# EAGLE schematic Blueberry Pi (EAGLE 9.0.0)

## Sheet 1 of 6: IO / LRADC / RTL8237BS / Touch / SPI Flash
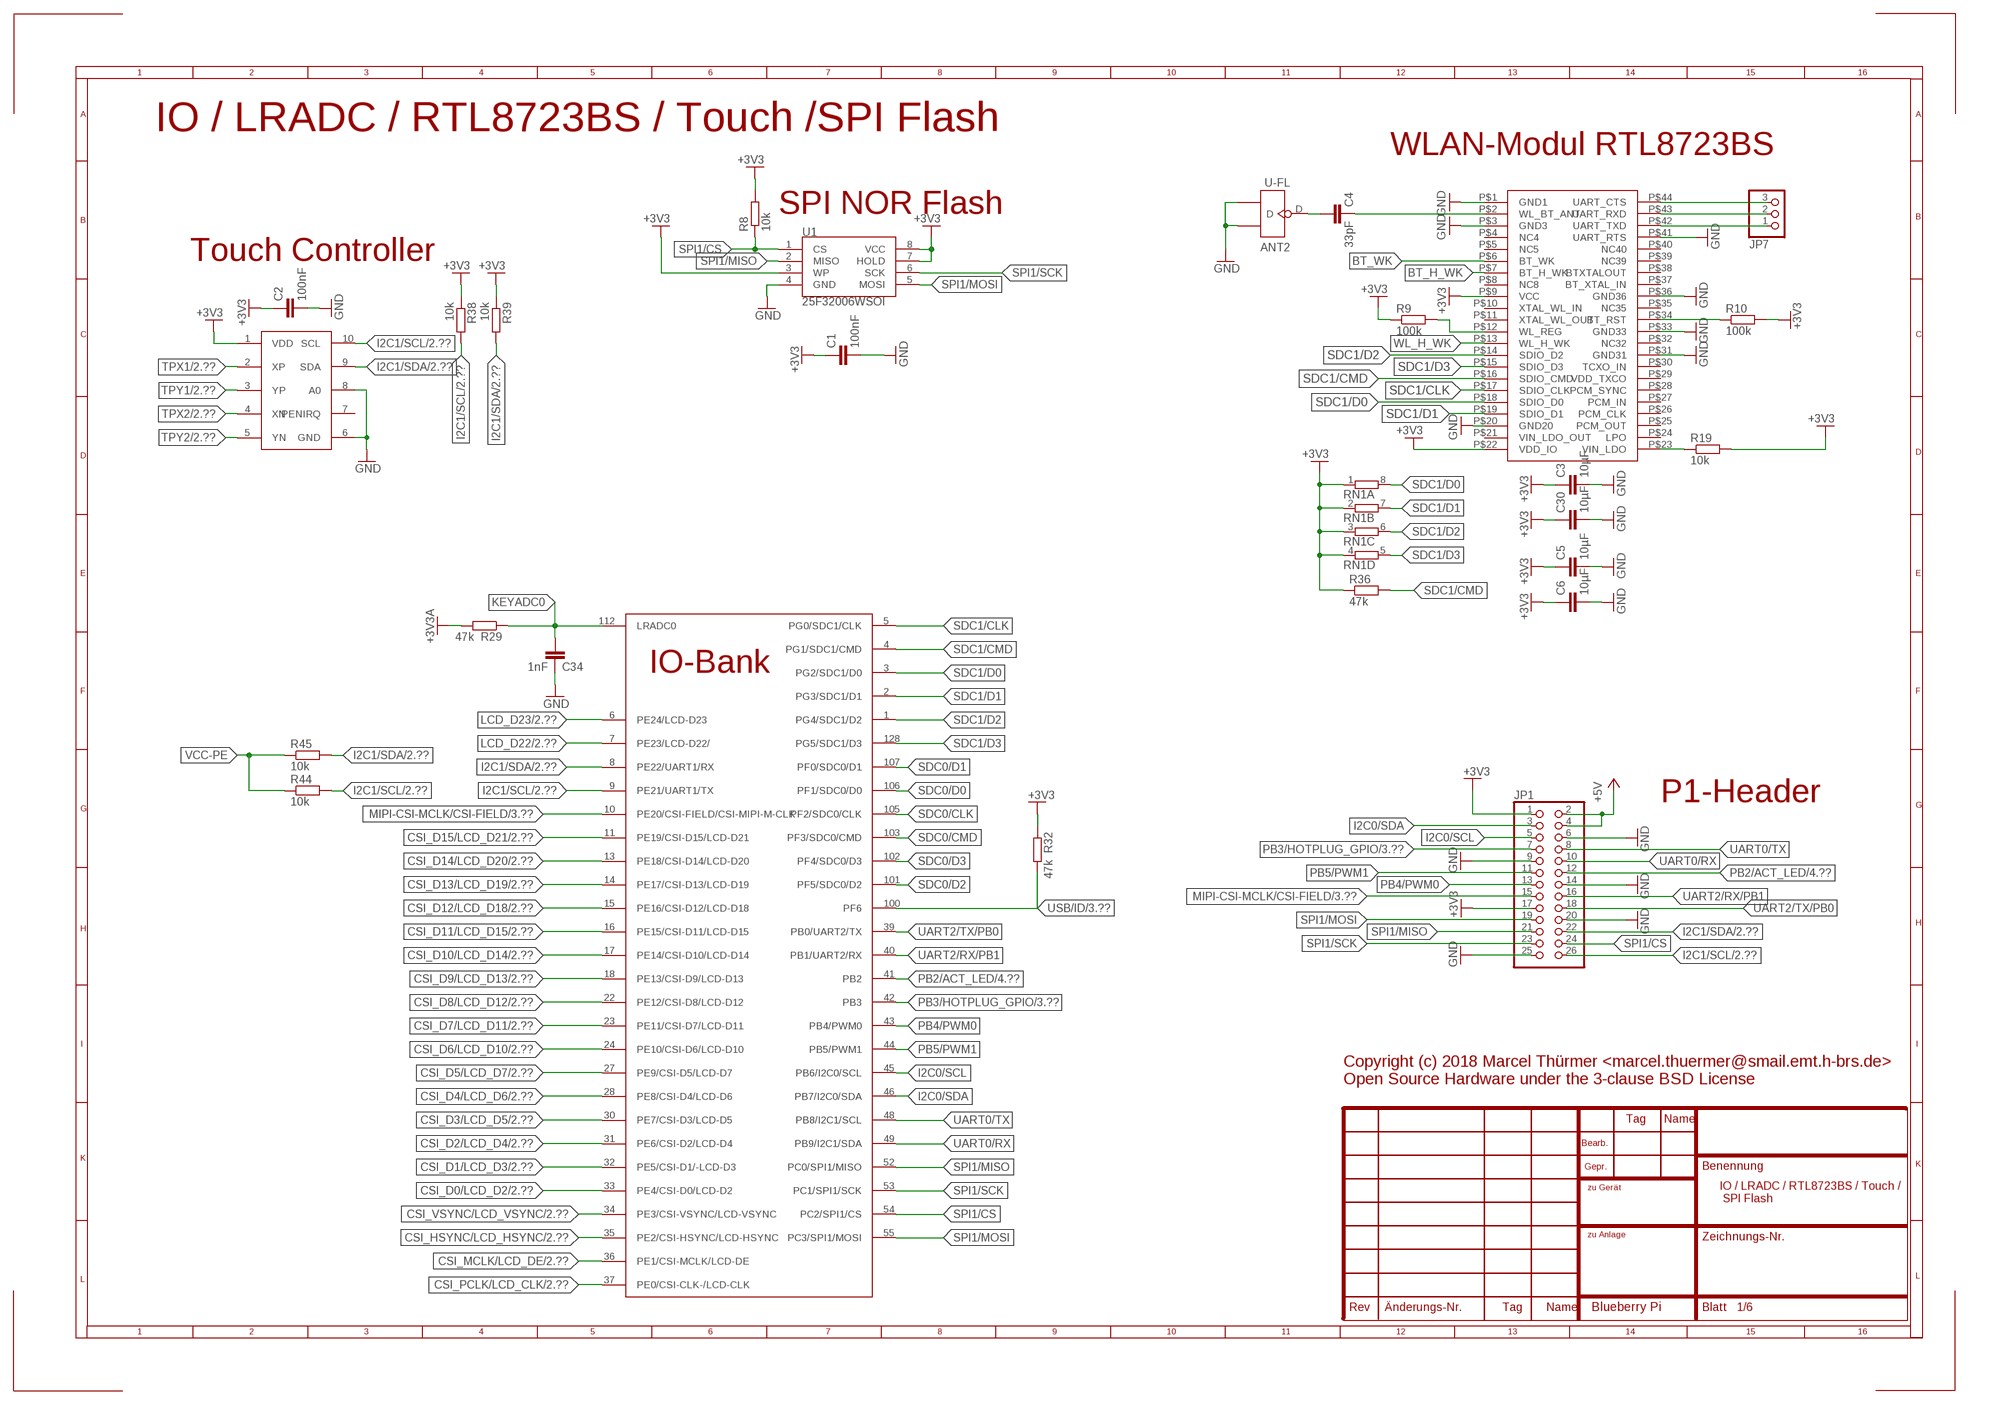
[diagram p0: schematic, sheet 1]

### Parts
ANT2  U-FL  ANTENNA-CONN-U-FL(3P)  [U-FL3P-SMD-2.6X2.6X1.0MM]
C1  100nF  C-EUC0603  [C0603]
C2  100nF  C-EUC0603  [C0603]
C3  10µF  C-EUC0805  [C0805]
C4  33pF  C-EUC0603  [C0603]
C5  10µF  C-EUC0805  [C0805]
C6  10µF  C-EUC0805  [C0805]
C30  10µF  C-EUC0805  [C0805]
C34  1nF  C-EUC0603  [C0603]
JP1  PINHD-2X13  [2X13]
JP7  PINHD-1X3M  [1X03M]
R8  10k  R-EU_R0603  [R0603]
R9  100k  R-EU_R0603  [R0603]
R10  100k  R-EU_R0603  [R0603]
R19  10k  R-EU_R0603  [R0603]
R29  47k  R-EU_R0603  [R0603]
R32  47k  R-EU_R0603  [R0603]
R36  47k  R-EU_R0603  [R0603]
R38  10k  R-EU_R0603  [R0603]
R39  10k  R-EU_R0603  [R0603]
R44  10k  R-EU_R0603  [R0603]
R45  10k  R-EU_R0603  [R0603]
RN1  4R-NEXB38V  [EXB38V]
U1  25F32006WSOI  SPI_FLASH-X25XXSMD1  [SO08-EIAJ]
U$1  V3S  [QFP-128]
U$2  RTL8723BS  [LGA]
U$8  NS2009  [MSOP10]

### Nets
+3V3: C1.1 C2.1 C3.1 C5.1 C6.1 C30.1 JP1.1 JP1.17 R8.2 R9.1 R10.2 R19.2 R32.1 R36.1 R38.1 R39.1 RN1.1 RN1.2 RN1.3 RN1.4 U1.3(WP) U1.7(HOLD) U1.8(VCC) U$2.P$9(VCC) U$2.P$22(VDD_IO) U$8.1(VDD) ; also sheet 2,3,4,6
+3V3A: R29.2 ; also sheet 3,4
+5V: JP1.2 JP1.4 ; also sheet 3,4,5,6
BT_H_WK: U$2.P$7(BT_H_WK)
BT_WK: U$2.P$6(BT_WK)
CSI_D0/LCD_D2: U$1.33(PE4/CSI-D0/LCD-D2) ; also sheet 2,5,6
CSI_D1/LCD_D3: U$1.32(PE5/CSI-D1/-LCD-D3) ; also sheet 2,5,6
CSI_D2/LCD_D4: U$1.31(PE6/CSI-D2/LCD-D4) ; also sheet 2,5,6
CSI_D3/LCD_D5: U$1.30(PE7/CSI-D3/LCD-D5) ; also sheet 2,5,6
CSI_D4/LCD_D6: U$1.28(PE8/CSI-D4/LCD-D6) ; also sheet 2,5,6
CSI_D5/LCD_D7: U$1.27(PE9/CSI-D5/LCD-D7) ; also sheet 2,5,6
CSI_D6/LCD_D10: U$1.24(PE10/CSI-D6/LCD-D10) ; also sheet 2,5,6
CSI_D7/LCD_D11: U$1.23(PE11/CSI-D7/LCD-D11) ; also sheet 2,5,6
CSI_D8/LCD_D12: U$1.22(PE12/CSI-D8/LCD-D12) ; also sheet 2,5,6
CSI_D9/LCD_D13: U$1.18(PE13/CSI-D9/LCD-D13) ; also sheet 2,5,6
CSI_D10/LCD_D14: U$1.17(PE14/CSI-D10/LCD-D14) ; also sheet 2,5,6
CSI_D11/LCD_D15: U$1.16(PE15/CSI-D11/LCD-D15) ; also sheet 2,5,6
CSI_D12/LCD_D18: U$1.15(PE16/CSI-D12/LCD-D18) ; also sheet 2,5,6
CSI_D13/LCD_D19: U$1.14(PE17/CSI-D13/LCD-D19) ; also sheet 2,5,6
CSI_D14/LCD_D20: U$1.13(PE18/CSI-D14/LCD-D20) ; also sheet 2,5,6
CSI_D15/LCD_D21: U$1.11(PE19/CSI-D15/LCD-D21) ; also sheet 2,5,6
CSI_HSYNC/LCD_HSYNC: U$1.35(PE2/CSI-HSYNC/LCD-HSYNC) ; also sheet 2,5,6
CSI_MCLK/LCD_DE: U$1.36(PE1/CSI-MCLK/LCD-DE) ; also sheet 2,5
CSI_PCLK/LCD_CLK: U$1.37(PE0/CSI-CLK-/LCD-CLK) ; also sheet 2,5
CSI_VSYNC/LCD_VSYNC: U$1.34(PE3/CSI-VSYNC/LCD-VSYNC) ; also sheet 2,5,6
GND: ANT2.GND1 ANT2.GND2 C1.2 C2.2 C3.2 C5.2 C6.2 C30.2 C34.1 JP1.6 JP1.9 JP1.14 JP1.20 JP1.25 U1.4(GND) U$2.P$1(GND1) U$2.P$3(GND3) U$2.P$20(GND20) U$2.P$31(GND31) U$2.P$33(GND33) U$2.P$36(GND36) U$2.P$41(UART_RTS) U$8.6(GND) U$8.8(A0) ; also sheet 2,3,4,5,6
I2C0/SCL: JP1.5 U$1.45(PB6/I2C0/SCL)
I2C0/SDA: JP1.3 U$1.46(PB7/I2C0/SDA)
I2C1/SCL: JP1.26 R38.2 R44.2 U$1.9(PE21/UART1/TX) U$8.10(SCL) ; also sheet 2,3,5
I2C1/SDA: JP1.22 R39.2 R45.2 U$1.8(PE22/UART1/RX) U$8.9(SDA) ; also sheet 2,3,5
KEYADC0: C34.2 R29.1 U$1.112(LRADC0)
LCD_D22: U$1.7(PE23/LCD-D22/) ; also sheet 2,6
LCD_D23: U$1.6(PE24/LCD-D23) ; also sheet 2,6
MIPI-CSI-MCLK/CSI-FIELD: JP1.15 U$1.10(PE20/CSI-FIELD/CSI-MIPI-M-CLK) ; also sheet 3
N$2: ANT2.D C4.2
N$4: R19.1 U$2.P$23(VIN_LDO)
N$5: JP7.3 U$2.P$44(UART_CTS)
N$7: R9.2 U$2.P$12(WL_REG)
N$9: JP7.2 U$2.P$43(UART_RXD)
N$11: JP7.1 U$2.P$42(UART_TXD)
N$12: R10.1 U$2.P$34(BT_RST)
N$13: C4.1 U$2.P$2(WL_BT_ANT)
PB2/ACT_LED: JP1.12 U$1.41(PB2) ; also sheet 4
PB3/HOTPLUG_GPIO: JP1.7 U$1.42(PB3) ; also sheet 3,5
PB4/PWM0: JP1.13 U$1.43(PB4/PWM0)
PB5/PWM1: JP1.11 U$1.44(PB5/PWM1)
SDC0/CLK: U$1.105(PF2/SDC0/CLK) ; also sheet 3
SDC0/CMD: U$1.103(PF3/SDC0/CMD) ; also sheet 3
SDC0/D0: U$1.106(PF1/SDC0/D0) ; also sheet 3
SDC0/D1: U$1.107(PF0/SDC0/D1) ; also sheet 3
SDC0/D2: U$1.101(PF5/SDC0/D2) ; also sheet 3
SDC0/D3: U$1.102(PF4/SDC0/D3) ; also sheet 3
SDC1/CLK: U$1.5(PG0/SDC1/CLK) U$2.P$17(SDIO_CLK)
SDC1/CMD: R36.2 U$1.4(PG1/SDC1/CMD) U$2.P$16(SDIO_CMD)
SDC1/D0: RN1.8 U$1.3(PG2/SDC1/D0) U$2.P$18(SDIO_D0)
SDC1/D1: RN1.7 U$1.2(PG3/SDC1/D1) U$2.P$19(SDIO_D1)
SDC1/D2: RN1.6 U$1.1(PG4/SDC1/D2) U$2.P$14(SDIO_D2)
SDC1/D3: RN1.5 U$1.128(PG5/SDC1/D3) U$2.P$15(SDIO_D3)
SPI1/CS: JP1.24 R8.1 U1.1(CS) U$1.54(PC2/SPI1/CS)
SPI1/MISO: JP1.21 U1.2(MISO) U$1.52(PC0/SPI1/MISO)
SPI1/MOSI: JP1.19 U1.5(MOSI) U$1.55(PC3/SPI1/MOSI)
SPI1/SCK: JP1.23 U1.6(SCK) U$1.53(PC1/SPI1/SCK)
TPX1: U$8.2(XP) ; also sheet 2
TPX2: U$8.4(XN) ; also sheet 2
TPY1: U$8.3(YP) ; also sheet 2
TPY2: U$8.5(YN) ; also sheet 2
UART0/RX: JP1.10 U$1.49(PB9/I2C1/SDA)
UART0/TX: JP1.8 U$1.48(PB8/I2C1/SCL)
UART2/RX/PB1: JP1.16 U$1.40(PB1/UART2/RX)
UART2/TX/PB0: JP1.18 U$1.39(PB0/UART2/TX)
USB/ID: R32.2 U$1.100(PF6) ; also sheet 3
VCC-PE: R44.1 R45.1 ; also sheet 4
WL_H_WK: U$2.P$13(WL_H_WK)
Unconnected: U$2.P$4(NC4) U$2.P$5(NC5) U$2.P$8(NC8) U$2.P$10(XTAL_WL_IN) U$2.P$11(XTAL_WL_OUT) U$2.P$21(VIN_LDO_OUT) U$2.P$24(LPO) U$2.P$25(PCM_OUT) U$2.P$26(PCM_CLK) U$2.P$27(PCM_IN) U$2.P$28(PCM_SYNC) U$2.P$29(VDD_TXCO) U$2.P$30(TCXO_IN) U$2.P$32(NC32) U$2.P$35(NC35) U$2.P$37(BT_XTAL_IN) U$2.P$38(BTXTALOUT) U$2.P$39(NC39) U$2.P$40(NC40) U$8.7(PENIRQ)

### Notes on the sheet
- IO / LRADC / RTL8723BS / Touch /SPI Flash
- WLAN-Modul RTL8723BS
- SPI NOR Flash
- Touch Controller
- P1-Header
- Copyright (c) 2018 Marcel Thürmer <marcel.thuermer@smail.emt.h-brs.de>
  Open Source Hardware under the 3-clause BSD License
- IO / LRADC / RTL8723BS / Touch /
   SPI Flash

## Sheet 2 of 6: LCD FFC / Camera FFC / Camera Header (OV7670, OV2640)
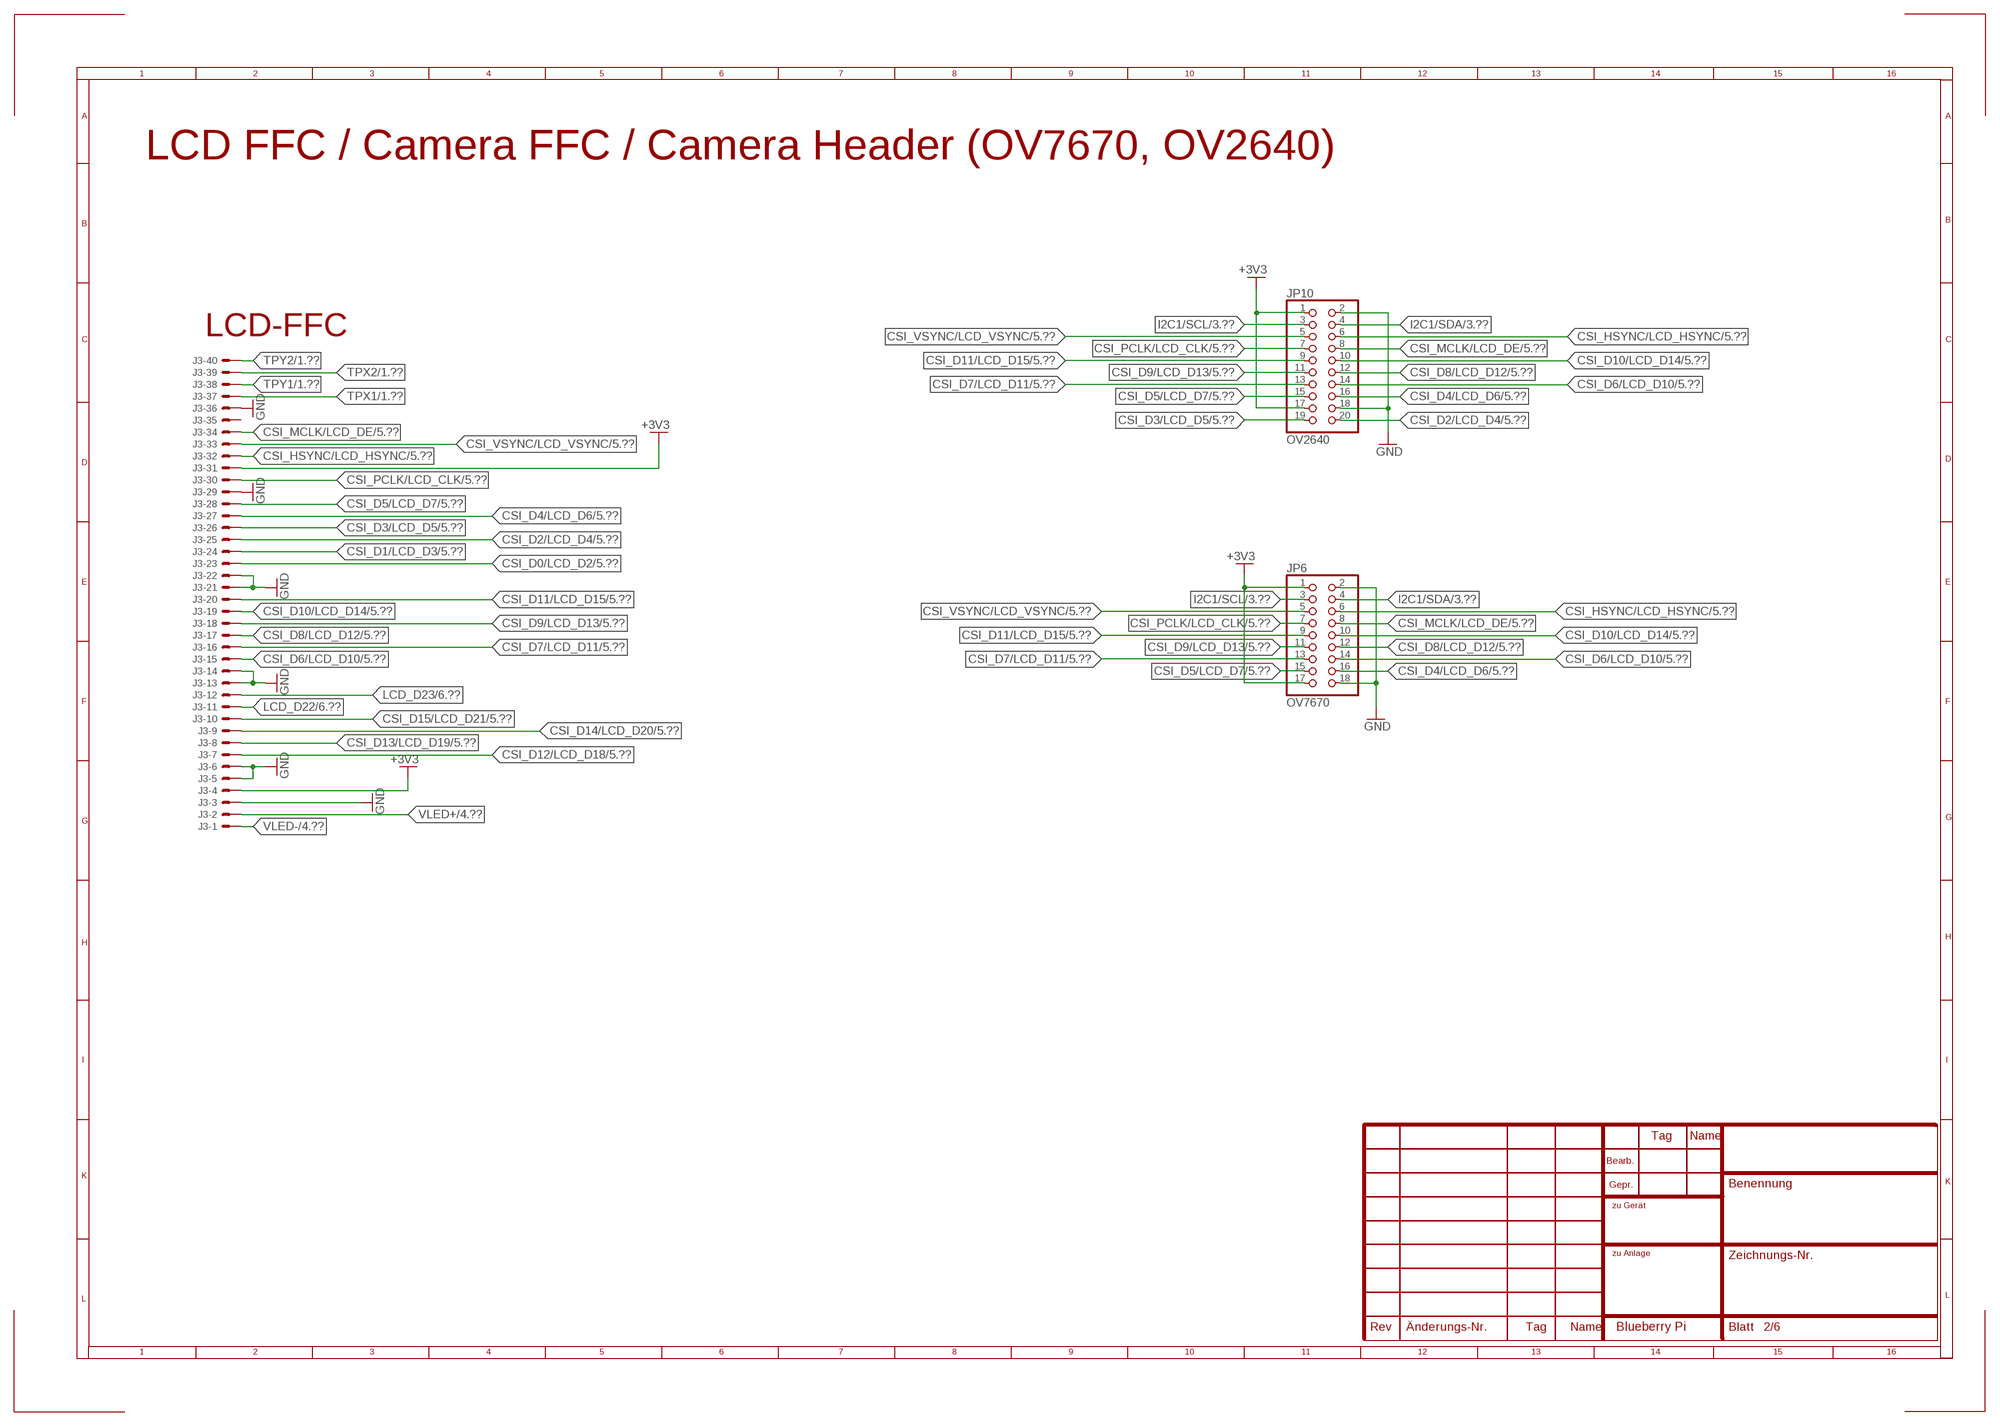
[diagram p1: schematic, sheet 2]

### Parts
J3  40PINFPCH15-1LW  [XF2H-4015-1LW]
JP6  OV7670  PINHD-2X9  [2X09]
JP10  OV2640  PINHD-2X10  [2X10]

### Nets
+3V3: J3.4 J3.31 JP6.1 JP6.17 JP10.1 JP10.17 ; also sheet 1,3,4,6
CSI_D0/LCD_D2: J3.23 ; also sheet 1,5,6
CSI_D1/LCD_D3: J3.24 ; also sheet 1,5,6
CSI_D2/LCD_D4: J3.25 JP10.20 ; also sheet 1,5,6
CSI_D3/LCD_D5: J3.26 JP10.19 ; also sheet 1,5,6
CSI_D4/LCD_D6: J3.27 JP6.16 JP10.16 ; also sheet 1,5,6
CSI_D5/LCD_D7: J3.28 JP6.15 JP10.15 ; also sheet 1,5,6
CSI_D6/LCD_D10: J3.15 JP6.14 JP10.14 ; also sheet 1,5,6
CSI_D7/LCD_D11: J3.16 JP6.13 JP10.13 ; also sheet 1,5,6
CSI_D8/LCD_D12: J3.17 JP6.12 JP10.12 ; also sheet 1,5,6
CSI_D9/LCD_D13: J3.18 JP6.11 JP10.11 ; also sheet 1,5,6
CSI_D10/LCD_D14: J3.19 JP6.10 JP10.10 ; also sheet 1,5,6
CSI_D11/LCD_D15: J3.20 JP6.9 JP10.9 ; also sheet 1,5,6
CSI_D12/LCD_D18: J3.7 ; also sheet 1,5,6
CSI_D13/LCD_D19: J3.8 ; also sheet 1,5,6
CSI_D14/LCD_D20: J3.9 ; also sheet 1,5,6
CSI_D15/LCD_D21: J3.10 ; also sheet 1,5,6
CSI_HSYNC/LCD_HSYNC: J3.32 JP6.6 JP10.6 ; also sheet 1,5,6
CSI_MCLK/LCD_DE: J3.34 JP6.8 JP10.8 ; also sheet 1,5
CSI_PCLK/LCD_CLK: J3.30 JP6.7 JP10.7 ; also sheet 1,5
CSI_VSYNC/LCD_VSYNC: J3.33 JP6.5 JP10.5 ; also sheet 1,5,6
GND: J3.3 J3.5 J3.6 J3.13 J3.14 J3.21 J3.22 J3.29 J3.36 JP6.2 JP6.18 JP10.2 JP10.18 ; also sheet 1,3,4,5,6
I2C1/SCL: JP6.3 JP10.3 ; also sheet 1,3,5
I2C1/SDA: JP6.4 JP10.4 ; also sheet 1,3,5
LCD_D22: J3.11 ; also sheet 1,6
LCD_D23: J3.12 ; also sheet 1,6
TPX1: J3.37 ; also sheet 1
TPX2: J3.39 ; also sheet 1
TPY1: J3.38 ; also sheet 1
TPY2: J3.40 ; also sheet 1
VLED+: J3.2 ; also sheet 4
VLED-: J3.1 ; also sheet 4
Unconnected: J3.35

### Notes on the sheet
- LCD FFC / Camera FFC / Camera Header (OV7670, OV2640)
- LCD-FFC

## Sheet 3 of 6: Ethernet / USB Host / SDC0 / Audio / MIPI CSI
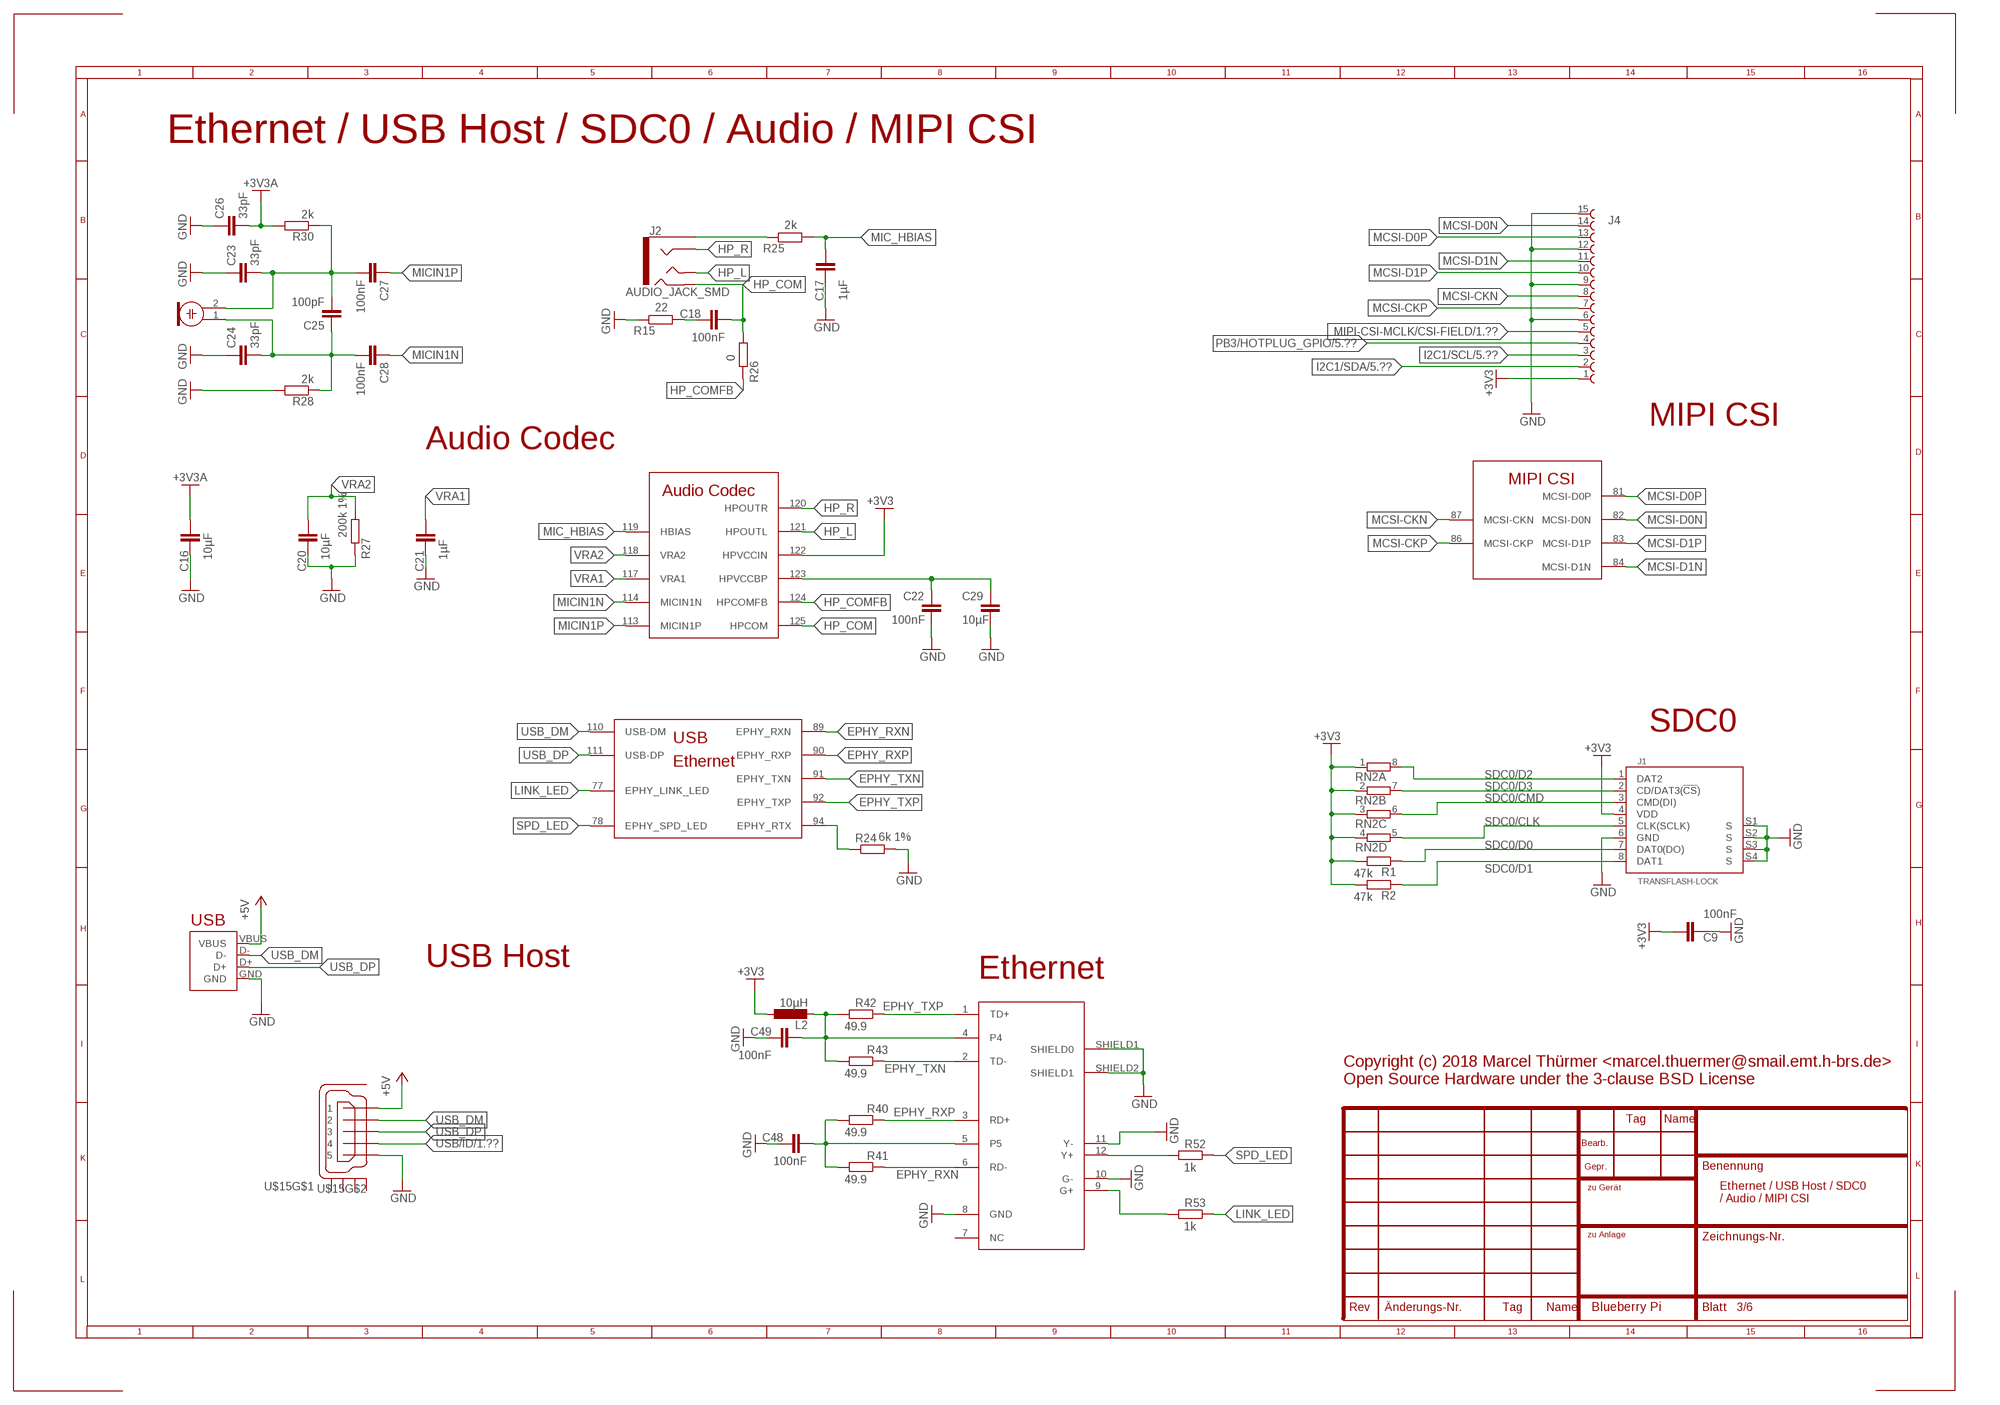
[diagram p2: schematic, sheet 3]

### Parts
C9  100nF  C-EUC0603  [C0603]
C16  10µF  C-EUC0805  [C0805]
C17  1µF  C-EUC0603  [C0603]
C18  100nF  C-EUC0603  [C0603]
C20  10µF  C-EUC0805  [C0805]
C21  1µF  C-EUC0603  [C0603]
C22  100nF  C-EUC0603  [C0603]
C23  33pF  C-EUC0603  [C0603]
C24  33pF  C-EUC0603  [C0603]
C25  100pF  C-EUC0603  [C0603]
C26  33pF  C-EUC0603  [C0603]
C27  100nF  C-EUC0603  [C0603]
C28  100nF  C-EUC0603  [C0603]
C29  10µF  C-EUC0805  [C0805]
C48  100nF  C-EUC0603  [C0603]
C49  100nF  C-EUC0603  [C0603]
J1  TRANSFLASH-LOCK  [TRANSFLASH-LOCK-SOCK]
J2  AUDIO_JACK_SMD  AUDIO_JACK_TRRSSMD_RA  [AUDIO_JACK_3.5MM_TRRS_SMD_RA]
J4  68611514122  [68611514122]
L2  10µH  L-EUL0805  [L0805]
MIC  ELECTRET_MICROPHON-F6035AP  [F6035AP]
R1  47k  R-EU_R0603  [R0603]
R2  47k  R-EU_R0603  [R0603]
R15  22  R-EU_R0603  [R0603]
R24  6k 1%  R-EU_R0603  [R0603]
R25  2k  R-EU_R0603  [R0603]
R26  0  R-EU_R0603  [R0603]
R27  200k 1%  R-EU_R0603  [R0603]
R28  2k  R-EU_R0603  [R0603]
R30  2k  R-EU_R0603  [R0603]
R40  49.9  R-EU_R0603  [R0603]
R41  49.9  R-EU_R0603  [R0603]
R42  49.9  R-EU_R0603  [R0603]
R43  49.9  R-EU_R0603  [R0603]
R52  1k  R-EU_R0603  [R0603]
R53  1k  R-EU_R0603  [R0603]
RN2  4R-NEXB38V  [EXB38V]
U$3  HR911105A  [RJ45]
U$15  CON-HIROSE_MICRO-USB-SHIELD-ZX62R-B-5P  [CON-HIROSE_ZX62R-B-5P]
X1  USB-B-S  [USB-B-SMT]

### Nets
+3V3: C9.1 J1.4(VDD) J4.1 L2.1 R1.2 R2.2 RN2.1 RN2.2 RN2.3 RN2.4 U$1.122(HPVCCIN) ; also sheet 1,2,4,6
+3V3A: C16.2 C26.2 R30.2 ; also sheet 1,4
+5V: U$15.1 X1.VBUS ; also sheet 1,4,5,6
EPHY_RXN: R41.1 U$1.89(EPHY_RXN) U$3.6(RD-)
EPHY_RXP: R40.1 U$1.90(EPHY_RXP) U$3.3(RD+)
EPHY_TXN: R43.1 U$1.91(EPHY_TXN) U$3.2(TD-)
EPHY_TXP: R42.1 U$1.92(EPHY_TXP) U$3.1(TD+)
GND: C9.2 C16.1 C17.2 C20.1 C21.1 C22.2 C23.1 C24.1 C26.1 C29.1 C48.2 C49.2 J1.6(GND) J1.S1(S) J1.S2(S) J1.S3(S) J1.S4(S) J4.6 J4.9 J4.12 J4.15 R15.1 R24.2 R27.1 R28.2 U$3.8(GND) U$3.10(G-) U$3.11(Y-) U$3.SHIELD1(SHIELD0) U$3.SHIELD2(SHIELD1) U$15.5 X1.GND ; also sheet 1,2,4,5,6
HP_COM: C18.2 J2.RING2 R26.2 U$1.125(HPCOM)
HP_COMFB: R26.1 U$1.124(HPCOMFB)
HP_L: J2.TIP U$1.121(HPOUTL)
HP_R: J2.RING1 U$1.120(HPOUTR)
I2C1/SCL: J4.3 ; also sheet 1,2,5
I2C1/SDA: J4.2 ; also sheet 1,2,5
LINK_LED: R53.1 U$1.77(EPHY_LINK_LED)
MCSI-CKN: J4.8 U$1.87(MCSI-CKN)
MCSI-CKP: J4.7 U$1.86(MCSI-CKP)
MCSI-D0N: J4.14 U$1.82(MCSI-D0N)
MCSI-D0P: J4.13 U$1.81(MCSI-D0P)
MCSI-D1N: J4.11 U$1.84(MCSI-D1N)
MCSI-D1P: J4.10 U$1.83(MCSI-D1P)
MIC_HBIAS: C17.1 R25.2 U$1.119(HBIAS)
MICIN1N: C28.1 U$1.114(MICIN1N)
MICIN1P: C27.1 U$1.113(MICIN1P)
MIPI-CSI-MCLK/CSI-FIELD: J4.5 ; also sheet 1
N$1: R24.1 U$1.94(EPHY_RTX)
N$18: R53.2 U$3.9(G+)
N$20: R52.2 U$3.12(Y+)
N$21: C49.1 L2.2 R42.2 R43.2 U$3.4
N$22: C48.1 R40.2 R41.2 U$3.5
N$28: C22.1 C29.2 U$1.123(HPVCCBP)
N$46: J2.EARTH R25.1
N$47: C18.1 R15.2
N$48: C23.2 C25.2 C27.2 MIC.2 R30.1
N$49: C24.2 C25.1 C28.2 MIC.1 R28.1
PB3/HOTPLUG_GPIO: J4.4 ; also sheet 1,5
SDC0/CLK: J1.5(CLK(SCLK)) RN2.5 ; also sheet 1
SDC0/CMD: J1.3(CMD(DI)) RN2.6 ; also sheet 1
SDC0/D0: J1.7(DAT0(DO)) R1.1 ; also sheet 1
SDC0/D1: J1.8(DAT1) R2.1 ; also sheet 1
SDC0/D2: J1.1(DAT2) RN2.8 ; also sheet 1
SDC0/D3: J1.2(CD/DAT3(!CS!)) RN2.7 ; also sheet 1
SPD_LED: R52.1 U$1.78(EPHY_SPD_LED)
USB/ID: U$15.4 ; also sheet 1
USB_DM: U$1.110(USB-DM) U$15.2 X1.D-
USB_DP: U$1.111(USB-DP) U$15.3 X1.D+
VRA1: C21.2 U$1.117(VRA1)
VRA2: C20.2 R27.2 U$1.118(VRA2)
Unconnected: U$3.7(NC) U$15.M1(S1) U$15.M2(S2) U$15.M3(S3) U$15.M4(S4)

### Notes on the sheet
- Ethernet / USB Host / SDC0 / Audio / MIPI CSI
- MIPI CSI
- Audio Codec
- SDC0
- USB Host
- Ethernet
- Copyright (c) 2018 Marcel Thürmer <marcel.thuermer@smail.emt.h-brs.de>
  Open Source Hardware under the 3-clause BSD License
- Ethernet / USB Host / SDC0 
  / Audio / MIPI CSI

## Sheet 4 of 6: VCC / RTC / PLL
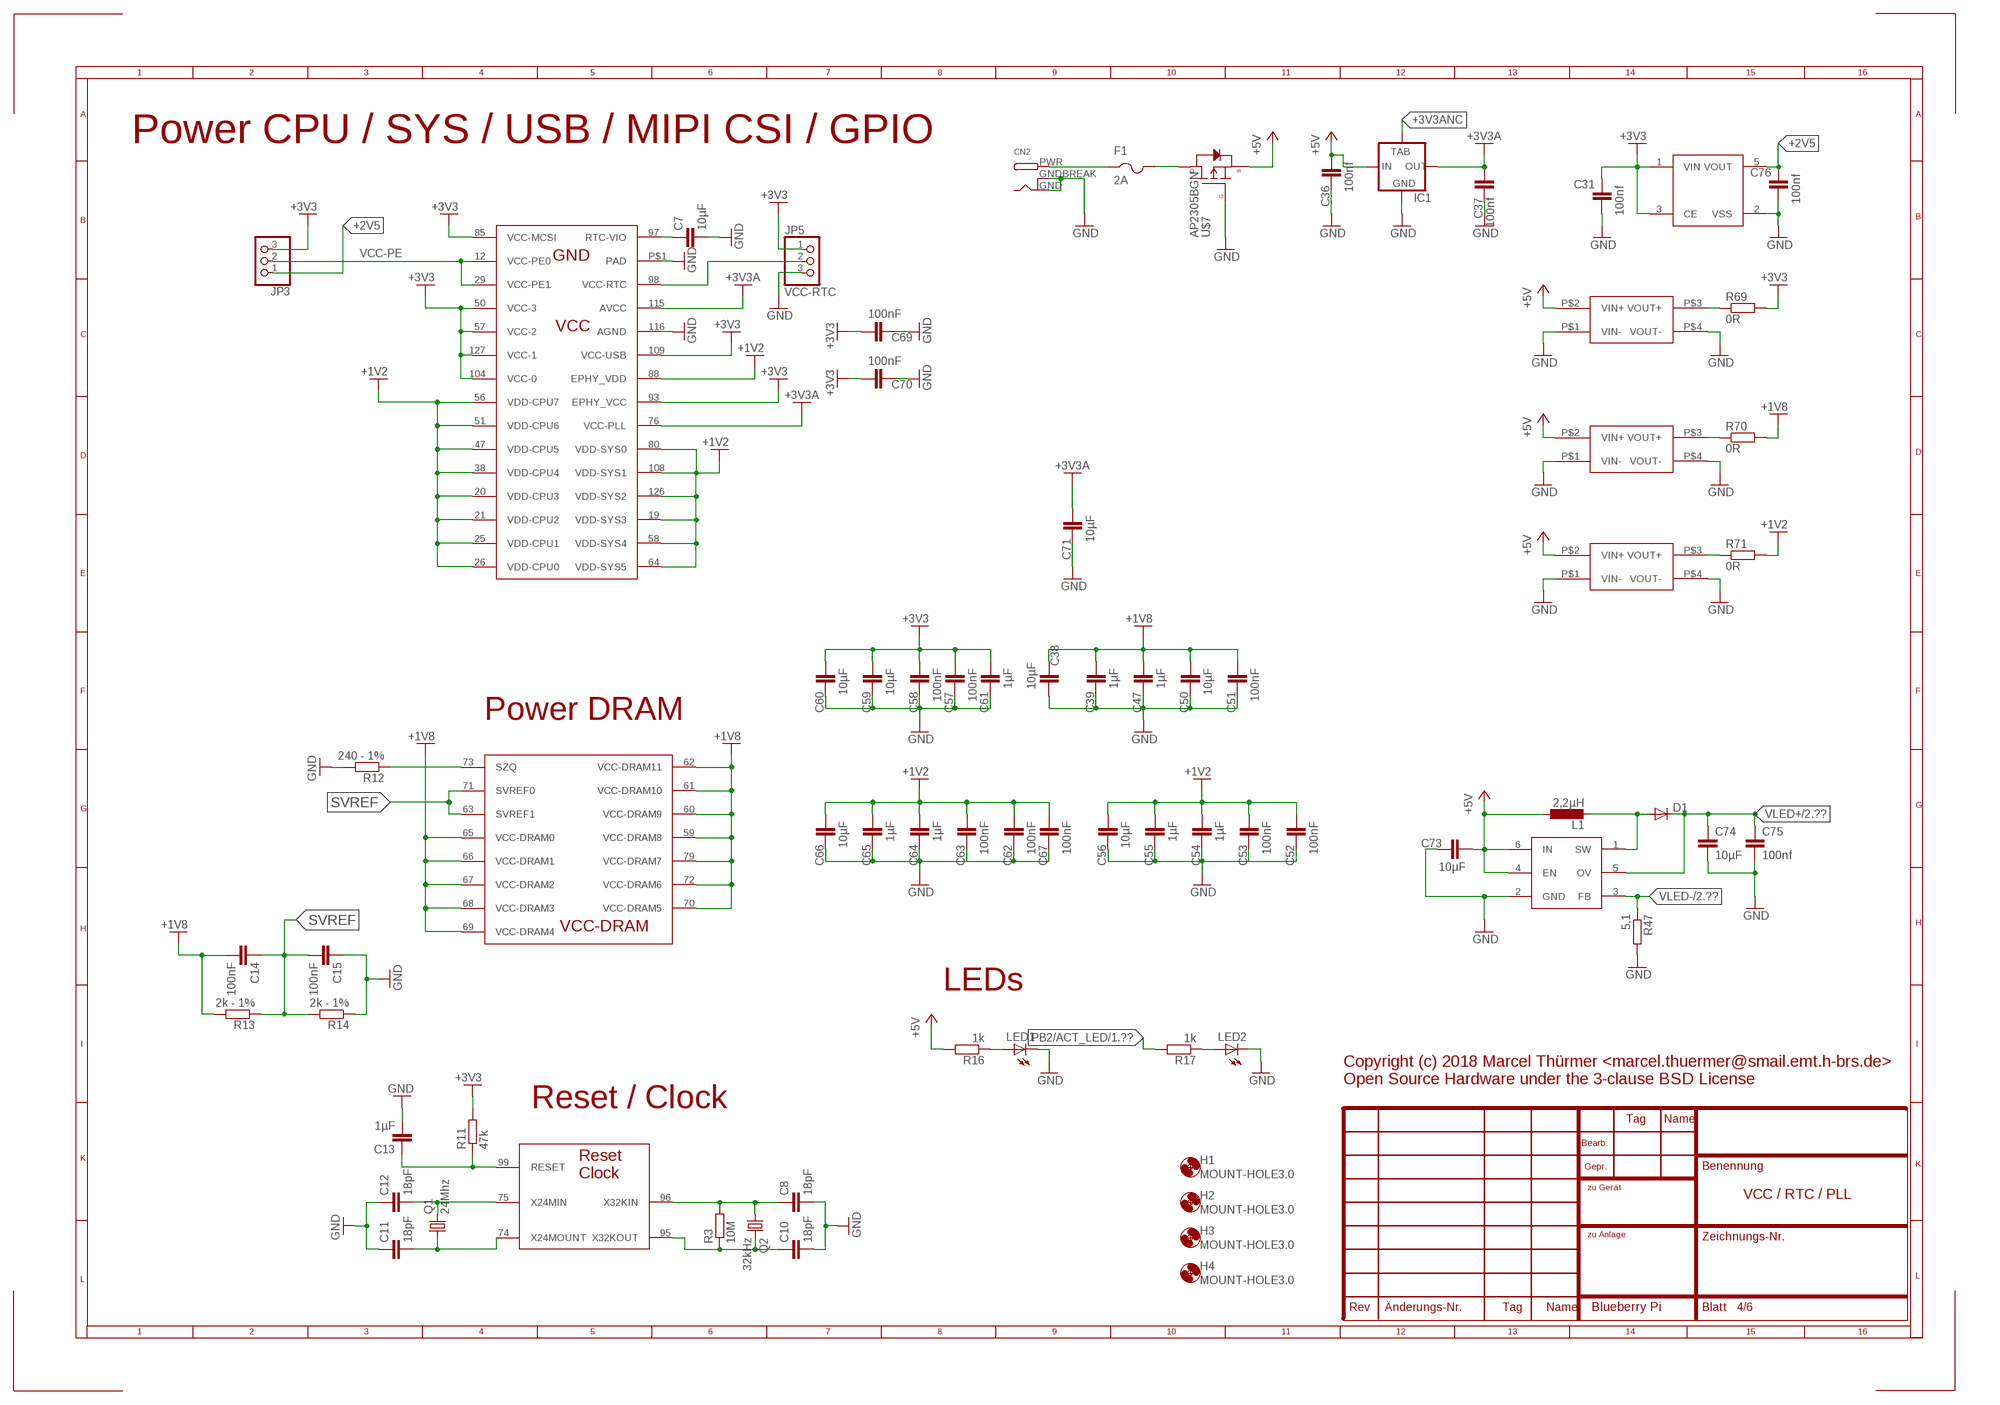
[diagram p3: schematic, sheet 4]

### Parts
C7  10µF  C-EUC0805  [C0805]
C8  18pF  C-EUC0603  [C0603]
C10  18pF  C-EUC0603  [C0603]
C11  18pF  C-EUC0603  [C0603]
C12  18pF  C-EUC0603  [C0603]
C13  1µF  C-EUC0603  [C0603]
C14  100nF  C-EUC0603  [C0603]
C15  100nF  C-EUC0603  [C0603]
C31  100nf  C-EUC0603  [C0603]
C36  100nf  C-EUC0603  [C0603]
C37  100nf  C-EUC0603  [C0603]
C38  10µF  C-EUC0603  [C0603]
C39  1µF  C-EUC0603  [C0603]
C47  1µF  C-EUC0603  [C0603]
C50  10µF  C-EUC0805  [C0805]
C51  100nF  C-EUC0603  [C0603]
C52  100nF  C-EUC0805  [C0805]
C53  100nF  C-EUC0603  [C0603]
C54  1µF  C-EUC0805  [C0805]
C55  1µF  C-EUC0603  [C0603]
C56  10µF  C-EUC0603  [C0603]
C57  100nF  C-EUC0603  [C0603]
C58  100nF  C-EUC0603  [C0603]
C59  10µF  C-EUC0805  [C0805]
C60  10µF  C-EUC0603  [C0603]
C61  1µF  C-EUC0805  [C0805]
C62  100nF  C-EUC0603  [C0603]
C63  100nF  C-EUC0805  [C0805]
C64  1µF  C-EUC0603  [C0603]
C65  1µF  C-EUC0603  [C0603]
C66  10µF  C-EUC0805  [C0805]
C67  100nF  C-EUC0603  [C0603]
C69  100nF  C-EUC0805  [C0805]
C70  100nF  C-EUC0603  [C0603]
C71  10µF  C-EUC0603  [C0603]
C73  10µF  C-EUC0805  [C0805]
C74  10µF  C-EUC0805  [C0805]
C75  100nf  C-EUC0603  [C0603]
C76  100nf  C-EUC0603  [C0603]
CN2  DCBARRELPTH  [DCJACK_2MM_PTH]
D1  DIODE-SOD323-W  [SOD323-W]
F1  2A  PTCFUSE-1206  [R1206]
H1  MOUNT-HOLE3.0  [3,0]
H2  MOUNT-HOLE3.0  [3,0]
H3  MOUNT-HOLE3.0  [3,0]
H4  MOUNT-HOLE3.0  [3,0]
IC1  LM1117  [SOT223]
JP3  PINHD-1X3  [1X03]
JP5  VCC-RTC  PINHD-1X3  [1X03]
L1  2,2µH  L-EU  [ODD-INDUCTOR]
LED1  LEDCHIPLED_0805  [CHIPLED_0805]
LED2  LEDCHIPLED_0805  [CHIPLED_0805]
Q1  24Mhz  CRYSTALHC49U-V  [HC49U-V]
Q2  32kHz  CRYSTALTC38H  [TC38H]
R3  10M  R-EU_R0603  [R0603]
R11  47k  R-EU_R0603  [R0603]
R12  240 - 1%  R-EU_R0603  [R0603]
R13  2k - 1%  R-EU_R0603  [R0603]
R14  2k - 1%  R-EU_R0603  [R0603]
R16  1k  R-EU_R0603  [R0603]
R17  1k  R-EU_R0603  [R0603]
R47  5,1  R-EU_R0603  [R0603]
R69  0R  R-EU_R0603  [R0603]
R70  0R  R-EU_R0603  [R0603]
R71  0R  R-EU_R0603  [R0603]
U$4  MP1584-MINI  [MINI-DC-BRICK]
U$6  XC6204  XC6204XC6204  [SOT25]
U$7  AP2305BGN  P-CHANNEL-MOSFET  [SOT23-3]
U$9  PT4101  [SOT23-6]
U$10  MP1584-MINI  [MINI-DC-BRICK]
U$11  MP1584-MINI  [MINI-DC-BRICK]

### Nets
5VNS: CN2.PWR F1.1
+1V2: C52.1 C53.1 C54.1 C55.1 C56.1 C62.1 C63.1 C64.1 C65.1 C66.1 C67.1 R71.2 U$1.19(VDD-SYS3) U$1.20(VDD-CPU3) U$1.21(VDD-CPU2) U$1.25(VDD-CPU1) U$1.26(VDD-CPU0) U$1.38(VDD-CPU4) U$1.47(VDD-CPU5) U$1.51(VDD-CPU6) U$1.56(VDD-CPU7) U$1.58(VDD-SYS4) U$1.64(VDD-SYS5) U$1.80(VDD-SYS0) U$1.88(EPHY_VDD) U$1.108(VDD-SYS1) U$1.126(VDD-SYS2)
+1V8: C14.2 C38.2 C39.1 C47.1 C50.1 C51.1 R13.2 R70.2 U$1.59(VCC-DRAM8) U$1.60(VCC-DRAM9) U$1.61(VCC-DRAM10) U$1.62(VCC-DRAM11) U$1.65(VCC-DRAM0) U$1.66(VCC-DRAM1) U$1.67(VCC-DRAM2) U$1.68(VCC-DRAM3) U$1.69(VCC-DRAM4) U$1.70(VCC-DRAM5) U$1.72(VCC-DRAM6) U$1.79(VCC-DRAM7)
+2V5: C76.1 JP3.1 U$6.5(VOUT)
+3V3: C31.1 C57.1 C58.1 C59.1 C60.1 C61.1 C69.1 C70.1 JP3.3 JP5.1 R11.2 R69.2 U$1.50(VCC-3) U$1.57(VCC-2) U$1.85(VCC-MCSI) U$1.93(EPHY_VCC) U$1.104(VCC-0) U$1.109(VCC-USB) U$1.127(VCC-1) U$6.1(VIN) U$6.3(CE) ; also sheet 1,2,3,6
+3V3A: C37.1 C71.1 IC1.2(OUT) U$1.76(VCC-PLL) U$1.115(AVCC) ; also sheet 1,3
+3V3ANC: IC1.4(IN1)
+5V: C36.1 C73.1 IC1.3(IN) L1.P$1 R16.2 U$4.P$2(VIN+) U$7.2(S) U$9.4(EN) U$9.6(IN) U$10.P$2(VIN+) U$11.P$2(VIN+) ; also sheet 1,3,5,6
GND: C7.2 C8.2 C10.2 C11.1 C12.1 C13.2 C15.1 C31.2 C36.2 C37.2 C38.1 C39.2 C47.2 C50.2 C51.2 C52.2 C53.2 C54.2 C55.2 C56.2 C57.2 C58.2 C59.2 C60.2 C61.2 C62.2 C63.2 C64.2 C65.2 C66.2 C67.2 C69.2 C70.2 C71.2 C73.2 C74.2 C75.2 C76.2 CN2.GND CN2.GNDBREAK IC1.1(GND) JP5.3 LED1.C LED2.C R12.2 R14.1 R47.2 U$1.116(AGND) U$1.P$1(PAD) U$4.P$1(VIN-) U$4.P$4(VOUT-) U$6.2(VSS) U$7.1(G) U$9.2(GND) U$10.P$1(VIN-) U$10.P$4(VOUT-) U$11.P$1(VIN-) U$11.P$4(VOUT-) ; also sheet 1,2,3,5,6
N$3: LED1.A R16.1
N$6: LED2.A R17.1
N$10: D1.A L1.P$2 U$9.1(SW)
N$23: C7.1 U$1.97(RTC-VIO)
N$26: JP5.2 U$1.98(VCC-RTC)
N$29: C10.1 Q2.2 R3.1 U$1.95(X32KOUT)
N$30: C8.1 Q2.1 R3.2 U$1.96(X32KIN)
N$32: C11.2 Q1.1 U$1.74(X24MOUNT)
N$33: C12.2 Q1.2 U$1.75(X24MIN)
N$35: C13.1 R11.1 U$1.99(RESET)
N$36: R12.1 U$1.73(SZQ)
N$55: R69.1 U$4.P$3(VOUT+)
N$56: R70.1 U$10.P$3(VOUT+)
N$57: F1.2 U$7.3(D)
N$58: R71.1 U$11.P$3(VOUT+)
PB2/ACT_LED: R17.2 ; also sheet 1
SVREF: C14.1 C15.2 R13.1 R14.2 U$1.63(SVREF1) U$1.71(SVREF0)
VCC-PE: JP3.2 U$1.12(VCC-PE0) U$1.29(VCC-PE1) ; also sheet 1
VLED+: C74.1 C75.1 D1.C U$9.5(OV) ; also sheet 2
VLED-: R47.1 U$9.3(FB) ; also sheet 2

### Notes on the sheet
- Power CPU / SYS / USB / MIPI CSI / GPIO
- Power DRAM
- LEDs
- Copyright (c) 2018 Marcel Thürmer <marcel.thuermer@smail.emt.h-brs.de>
  Open Source Hardware under the 3-clause BSD License
- Reset / Clock
- VCC / RTC / PLL

## Sheet 5 of 6: HDMI IN / ADV7611
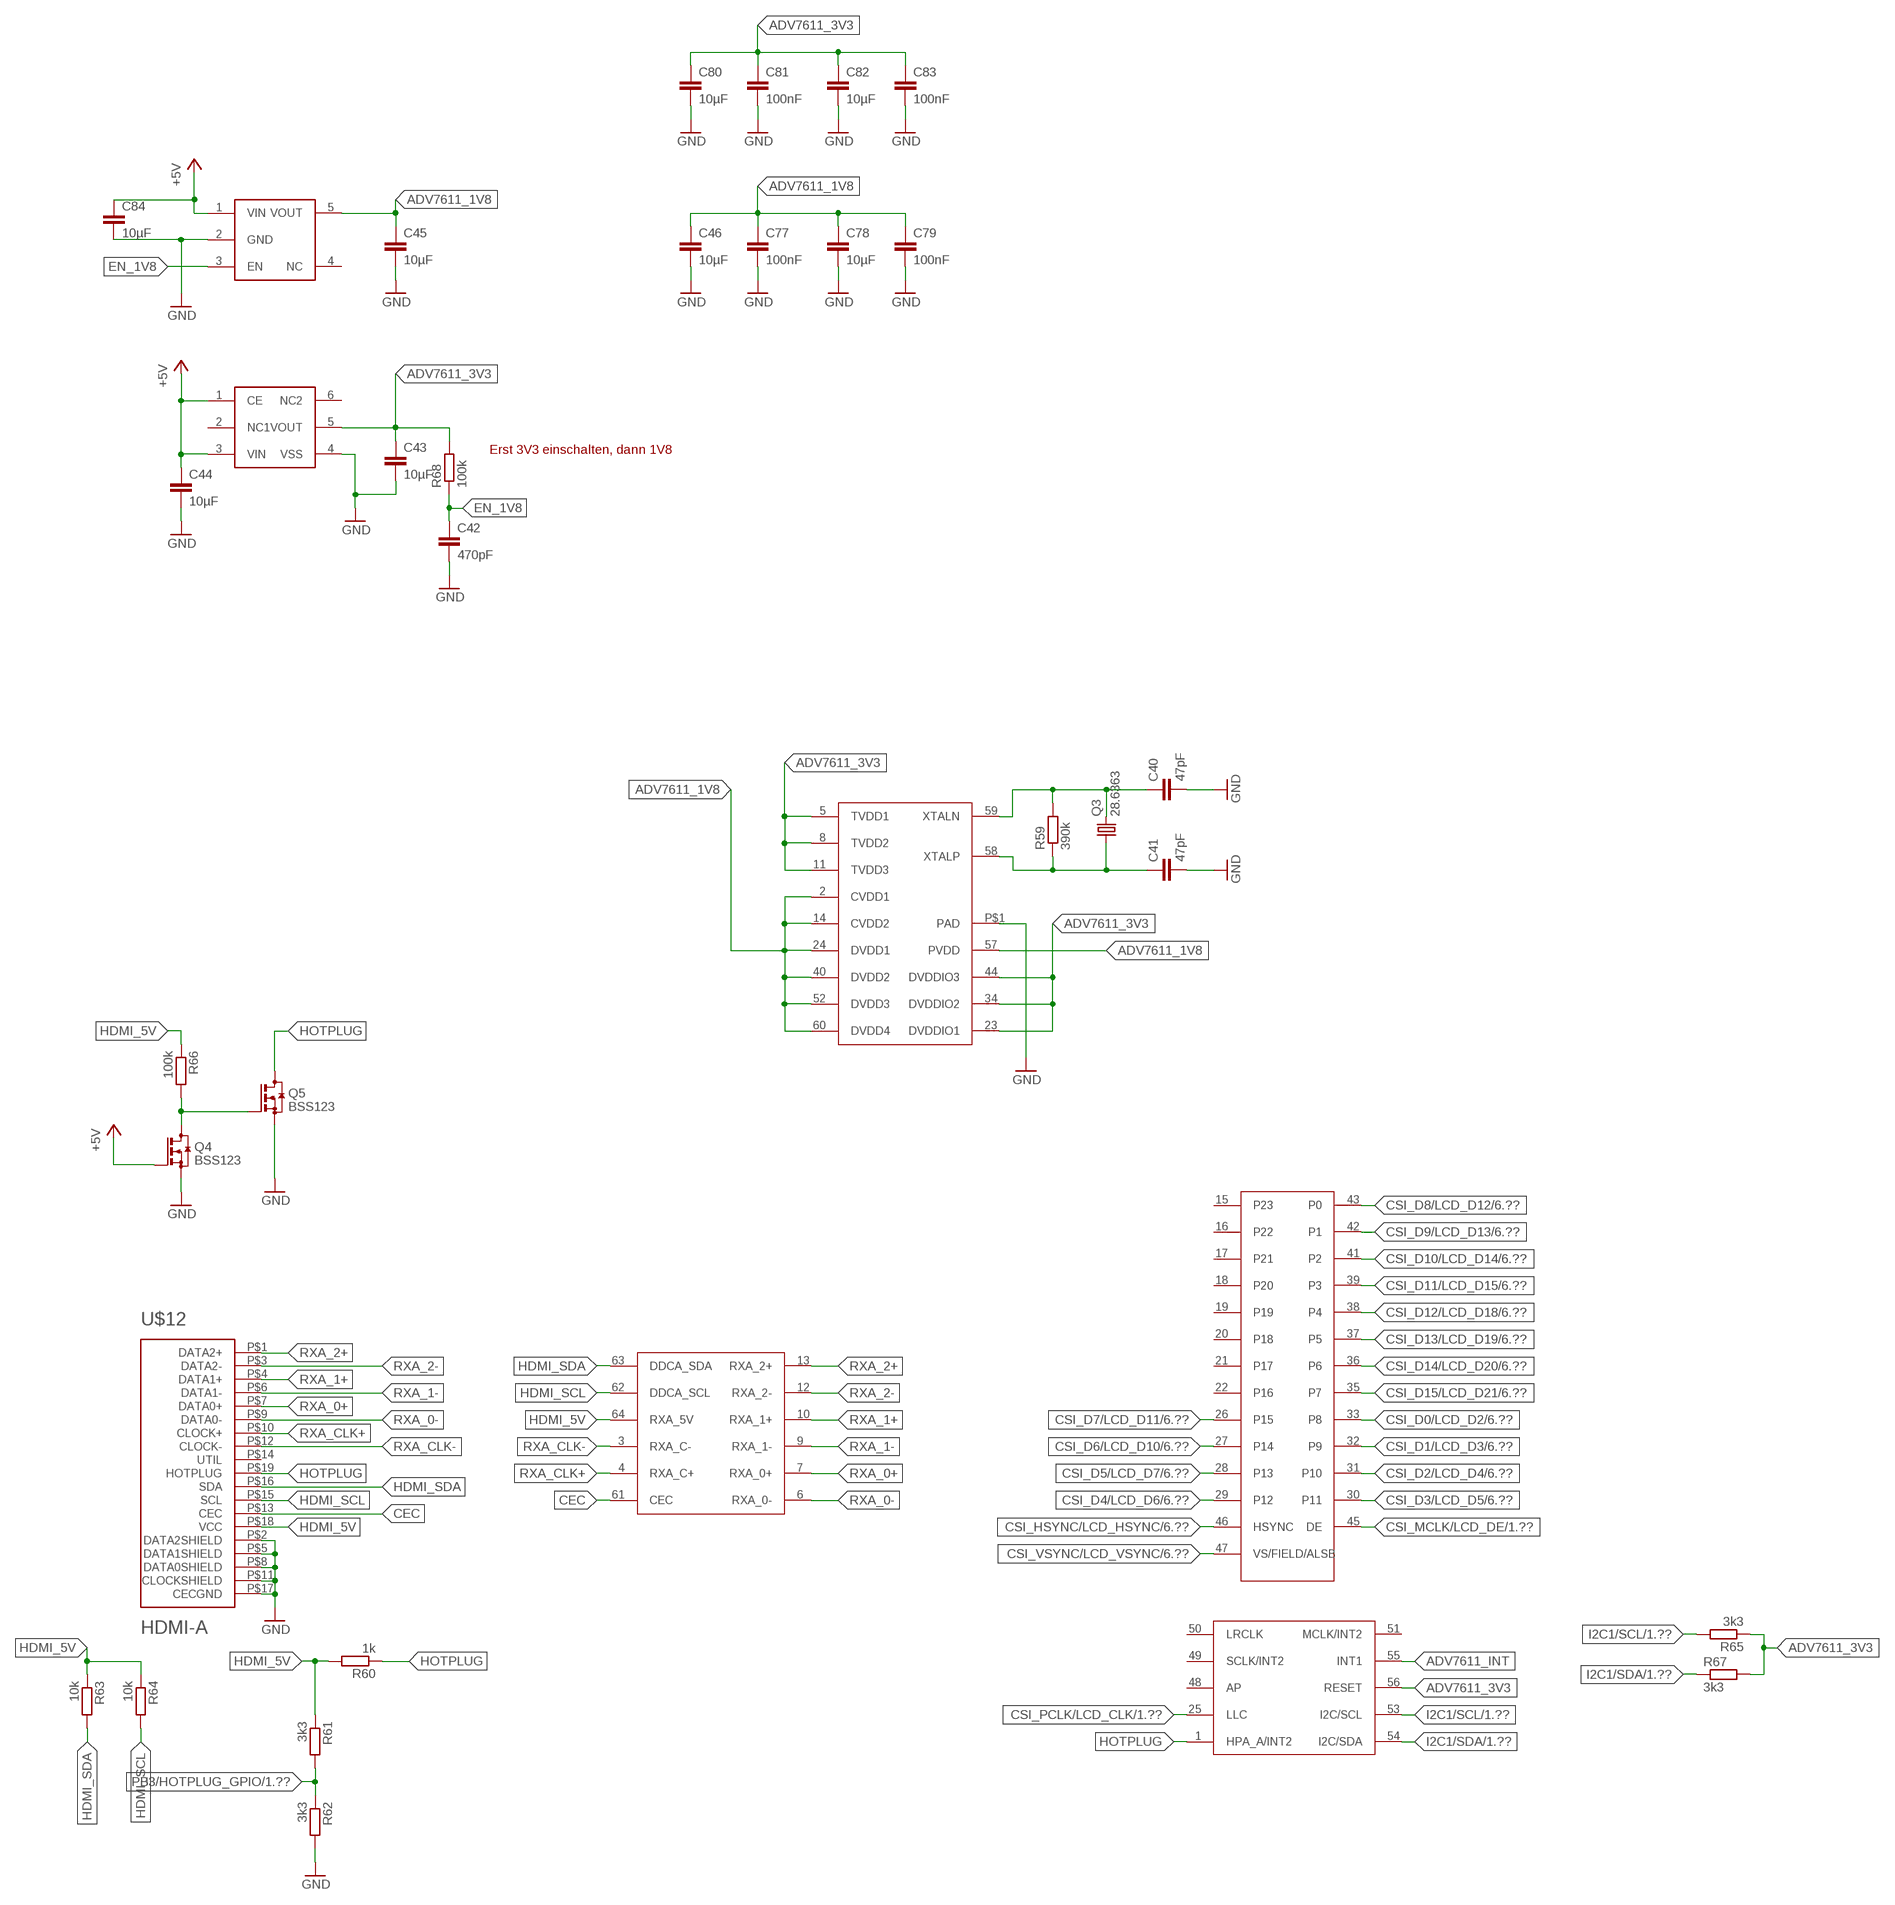
[diagram p4: schematic, sheet 5]

### Parts
C40  47pF  C-EUC0603  [C0603]
C41  47pF  C-EUC0603  [C0603]
C42  470pF  C-EUC0603  [C0603]
C43  10µF  C-EUC0805  [C0805]
C44  10µF  C-EUC0805  [C0805]
C45  10µF  C-EUC0805  [C0805]
C46  10µF  C-EUC0805  [C0805]
C77  100nF  C-EUC0603  [C0603]
C78  10µF  C-EUC0805  [C0805]
C79  100nF  C-EUC0603  [C0603]
C80  10µF  C-EUC0805  [C0805]
C81  100nF  C-EUC0603  [C0603]
C82  10µF  C-EUC0805  [C0805]
C83  100nF  C-EUC0603  [C0603]
C84  10µF  C-EUC0805  [C0805]
Q3  28.6363  CRYSTALHC49S  [HC49/S]
Q4  BSS123  [SOT23]
Q5  BSS123  [SOT23]
R59  390k  R-EU_R0603  [R0603]
R60  1k  R-EU_R0603  [R0603]
R61  3k3  R-EU_R0603  [R0603]
R62  3k3  R-EU_R0603  [R0603]
R63  10k  R-EU_R0603  [R0603]
R64  10k  R-EU_R0603  [R0603]
R65  3k3  R-EU_R0603  [R0603]
R66  100k  R-EU_R0603  [R0603]
R67  3k3  R-EU_R0603  [R0603]
R68  100k  R-EU_R0603  [R0603]
U$5  ADV7611  [QFP50P1210X1210X120-65T500]
U$12  HDMI-A  [HDMI_A]
U$13  XC6210B332MR-G  XC6210  [SOT-25]
U$14  RT9013-18GB  RT9013  [SOT-23-5]

### Nets
+5V: C44.1 C84.1 Q4.1(G) U$13.1(CE) U$13.3(VIN) U$14.1(VIN) ; also sheet 1,3,4,6
ADV7611_1V8: C45.1 C46.1 C77.1 C78.1 C79.1 U$5.2(CVDD1) U$5.14(CVDD2) U$5.24(DVDD1) U$5.40(DVDD2) U$5.52(DVDD3) U$5.57(PVDD) U$5.60(DVDD4) U$14.5(VOUT)
ADV7611_3V3: C43.1 C80.1 C81.1 C82.1 C83.1 R65.1 R67.2 R68.2 U$5.5(TVDD1) U$5.8(TVDD2) U$5.11(TVDD3) U$5.23(DVDDIO1) U$5.34(DVDDIO2) U$5.44(DVDDIO3) U$5.56(RESET) U$13.5(VOUT)
ADV7611_INT: U$5.55(INT1)
CEC: U$5.61(CEC) U$12.P$13(CEC)
CSI_D0/LCD_D2: U$5.33(P8) ; also sheet 1,2,6
CSI_D1/LCD_D3: U$5.32(P9) ; also sheet 1,2,6
CSI_D2/LCD_D4: U$5.31(P10) ; also sheet 1,2,6
CSI_D3/LCD_D5: U$5.30(P11) ; also sheet 1,2,6
CSI_D4/LCD_D6: U$5.29(P12) ; also sheet 1,2,6
CSI_D5/LCD_D7: U$5.28(P13) ; also sheet 1,2,6
CSI_D6/LCD_D10: U$5.27(P14) ; also sheet 1,2,6
CSI_D7/LCD_D11: U$5.26(P15) ; also sheet 1,2,6
CSI_D8/LCD_D12: U$5.43(P0) ; also sheet 1,2,6
CSI_D9/LCD_D13: U$5.42(P1) ; also sheet 1,2,6
CSI_D10/LCD_D14: U$5.41(P2) ; also sheet 1,2,6
CSI_D11/LCD_D15: U$5.39(P3) ; also sheet 1,2,6
CSI_D12/LCD_D18: U$5.38(P4) ; also sheet 1,2,6
CSI_D13/LCD_D19: U$5.37(P5) ; also sheet 1,2,6
CSI_D14/LCD_D20: U$5.36(P6) ; also sheet 1,2,6
CSI_D15/LCD_D21: U$5.35(P7) ; also sheet 1,2,6
CSI_HSYNC/LCD_HSYNC: U$5.46(HSYNC) ; also sheet 1,2,6
CSI_MCLK/LCD_DE: U$5.45(DE) ; also sheet 1,2
CSI_PCLK/LCD_CLK: U$5.25(LLC) ; also sheet 1,2
CSI_VSYNC/LCD_VSYNC: U$5.47(VS/FIELD/ALSB) ; also sheet 1,2,6
EN_1V8: C42.1 R68.1 U$14.3(EN)
GND: C40.2 C41.2 C42.2 C43.2 C44.2 C45.2 C46.2 C77.2 C78.2 C79.2 C80.2 C81.2 C82.2 C83.2 C84.2 Q4.2(S) Q5.2(S) R62.2 U$5.P$1(PAD) U$12.P$2(DATA2SHIELD) U$12.P$5(DATA1SHIELD) U$12.P$8(DATA0SHIELD) U$12.P$11(CLOCKSHIELD) U$12.P$17(CECGND) U$13.4(VSS) U$14.2(GND) ; also sheet 1,2,3,4,6
HDMI_5V: R60.2 R61.1 R63.1 R64.1 R66.1 U$5.64(RXA_5V) U$12.P$18(VCC)
HDMI_SCL: R64.2 U$5.62(DDCA_SCL) U$12.P$15(SCL)
HDMI_SDA: R63.2 U$5.63(DDCA_SDA) U$12.P$16(SDA)
HOTPLUG: Q5.3(D) R60.1 U$5.1(HPA_A/INT2) U$12.P$19(HOTPLUG)
I2C1/SCL: R65.2 U$5.53(I2C/SCL) ; also sheet 1,2,3
I2C1/SDA: R67.1 U$5.54(I2C/SDA) ; also sheet 1,2,3
N$52: C40.1 Q3.2 R59.2 U$5.59(XTALN)
N$53: C41.1 Q3.1 R59.1 U$5.58(XTALP)
N$54: Q4.3(D) Q5.1(G) R66.2
PB3/HOTPLUG_GPIO: R61.2 R62.1 ; also sheet 1,3
RXA_0+: U$5.7(RXA_0+) U$12.P$7(DATA0+)
RXA_0-: U$5.6(RXA_0-) U$12.P$9(DATA0-)
RXA_1+: U$5.10(RXA_1+) U$12.P$4(DATA1+)
RXA_1-: U$5.9(RXA_1-) U$12.P$6(DATA1-)
RXA_2+: U$5.13(RXA_2+) U$12.P$1(DATA2+)
RXA_2-: U$5.12(RXA_2-) U$12.P$3(DATA2-)
RXA_CLK+: U$5.4(RXA_C+) U$12.P$10(CLOCK+)
RXA_CLK-: U$5.3(RXA_C-) U$12.P$12(CLOCK-)
Unconnected: U$5.15(P23) U$5.16(P22) U$5.17(P21) U$5.18(P20) U$5.19 U$5.20(P18) U$5.21(P17) U$5.22(P16) U$5.48(AP) U$5.49(SCLK/INT2) U$5.50(LRCLK) U$5.51(MCLK/INT2) U$12.P$14(UTIL) U$13.2(NC1) U$13.6(NC2) U$14.4(NC)

### Notes on the sheet
- Erst 3V3 einschalten, dann 1V8

## Sheet 6 of 6: VGA
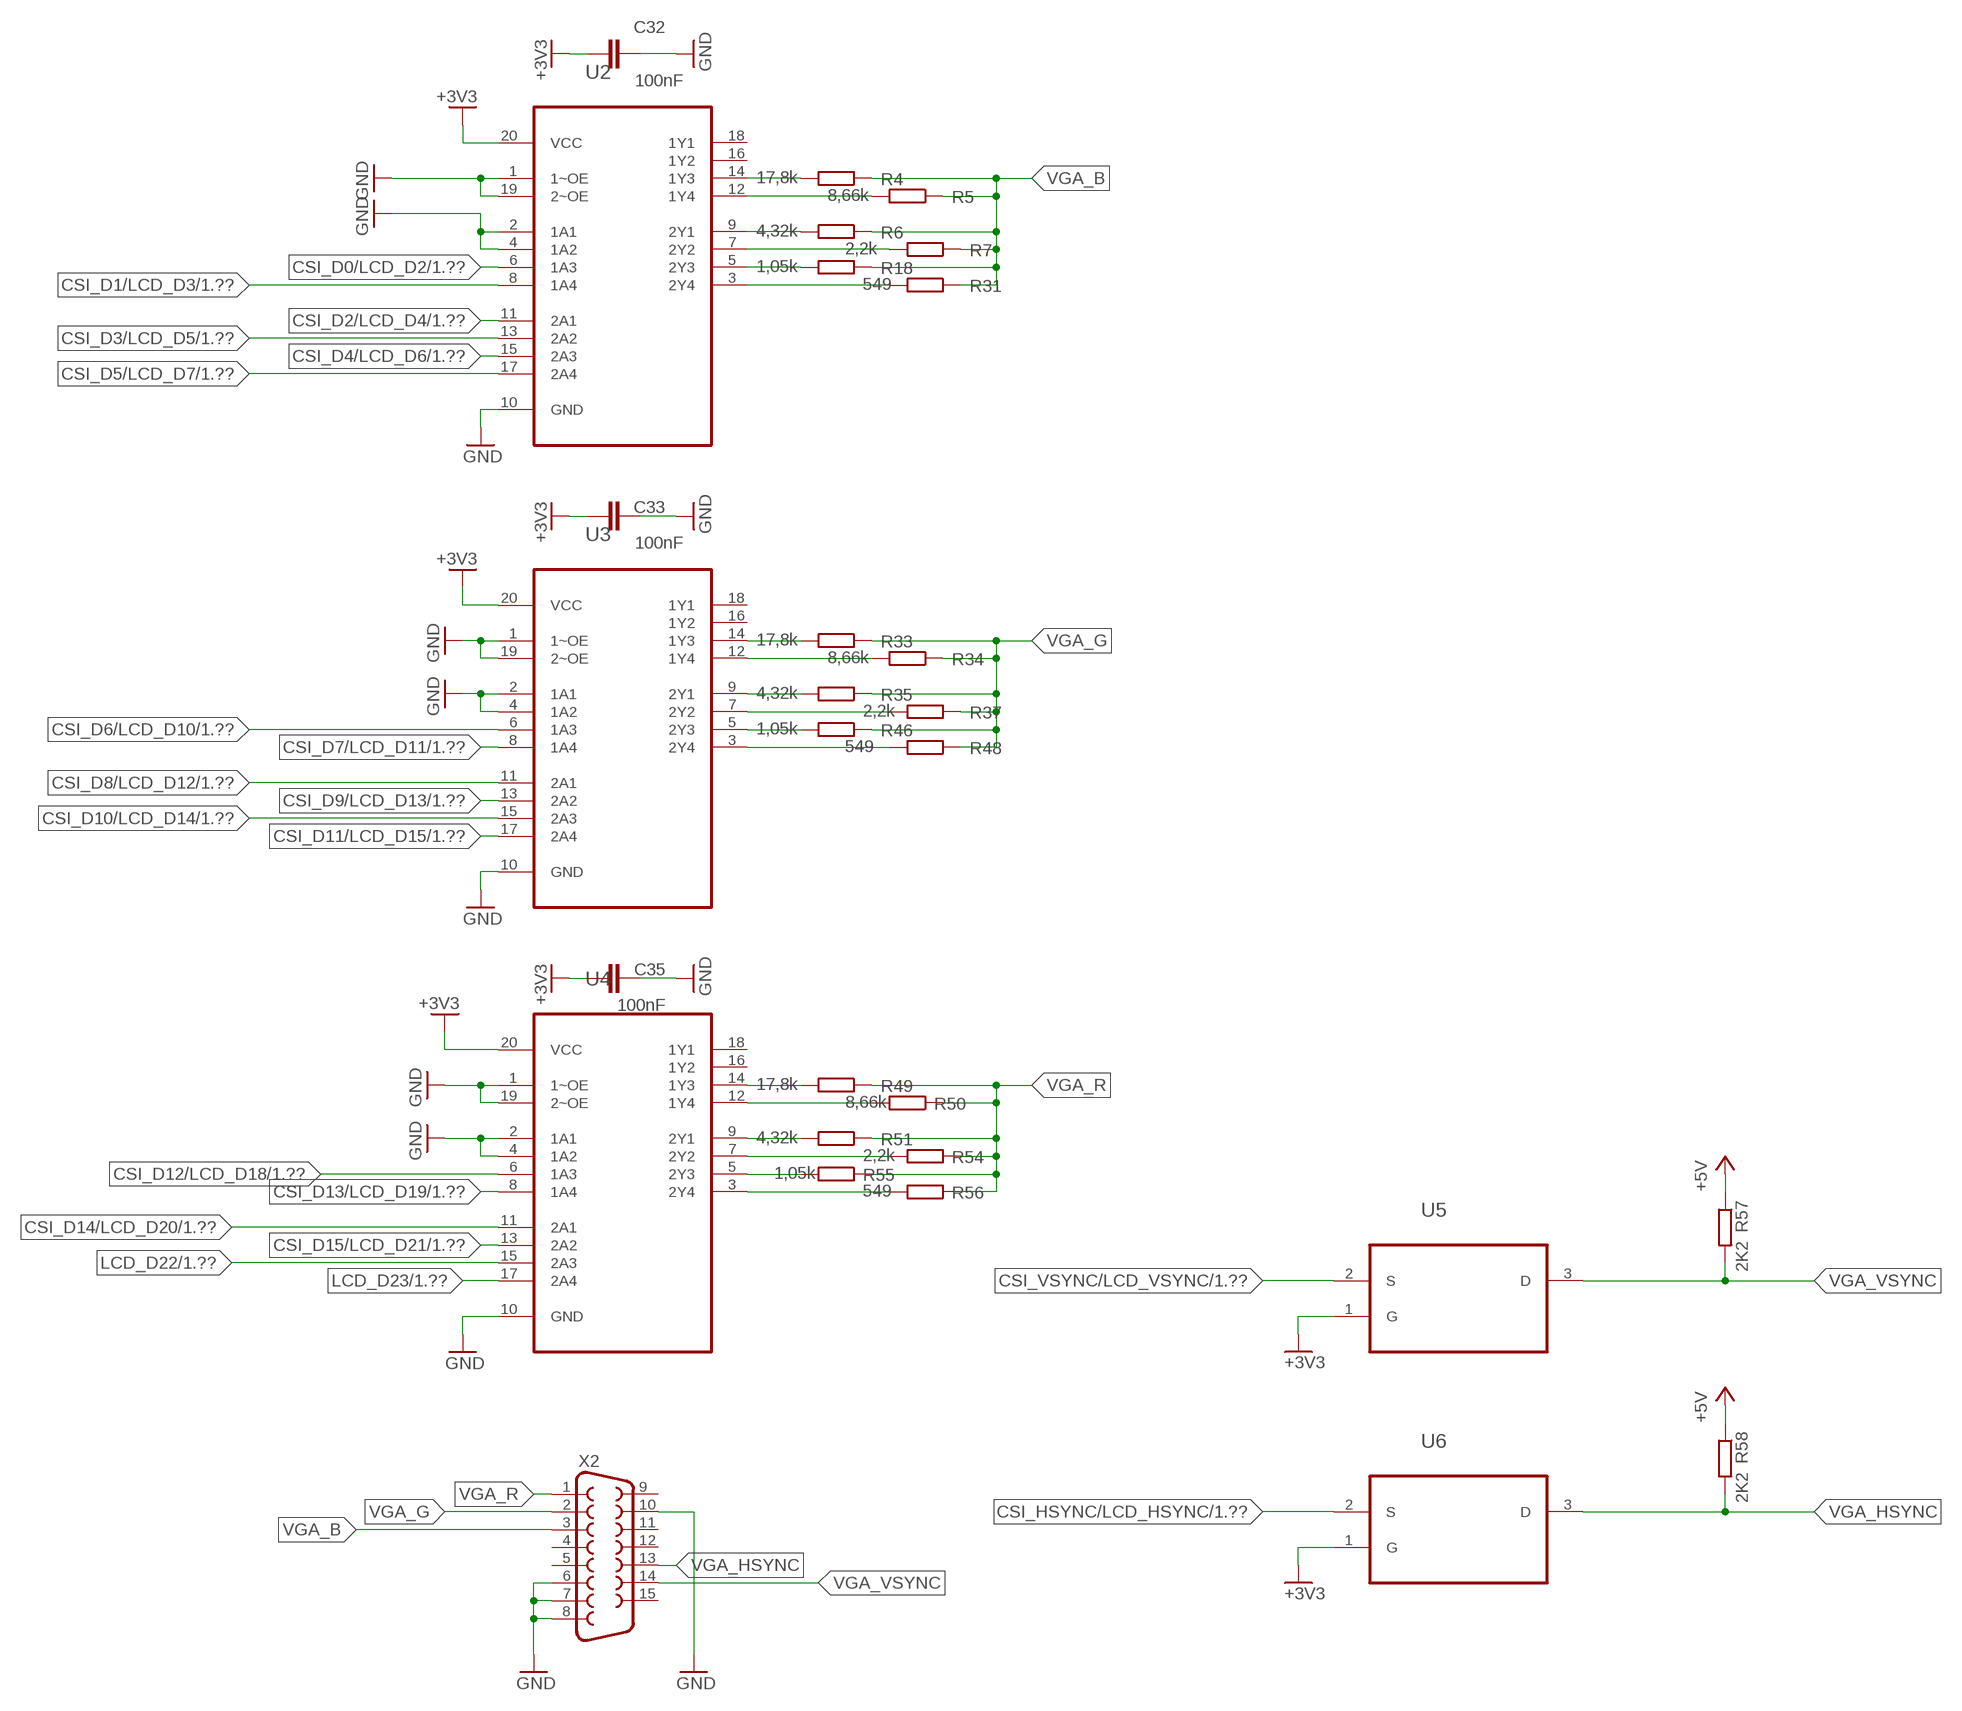
[diagram p5: schematic, sheet 6]

### Parts
C32  100nF  C-EUC0603  [C0603]
C33  100nF  C-EUC0603  [C0603]
C35  100nF  C-EUC0603  [C0603]
R4  17,8k  R-EU_R0603  [R0603]
R5  8,66k  R-EU_R0603  [R0603]
R6  4,32k  R-EU_R0603  [R0603]
R7  2,2k  R-EU_R0603  [R0603]
R18  1,05k  R-EU_R0603  [R0603]
R31  549  R-EU_R0603  [R0603]
R33  17,8k  R-EU_R0603  [R0603]
R34  8,66k  R-EU_R0603  [R0603]
R35  4,32k  R-EU_R0603  [R0603]
R37  2,2k  R-EU_R0603  [R0603]
R46  1,05k  R-EU_R0603  [R0603]
R48  549  R-EU_R0603  [R0603]
R49  17,8k  R-EU_R0603  [R0603]
R50  8,66k  R-EU_R0603  [R0603]
R51  4,32k  R-EU_R0603  [R0603]
R54  2,2k  R-EU_R0603  [R0603]
R55  1,05k  R-EU_R0603  [R0603]
R56  549  R-EU_R0603  [R0603]
R57  2K2  R-EU_R0603  [R0603]
R58  2K2  R-EU_R0603  [R0603]
U2  SN74ALVC244PW  [SOP65P640X120-20N]
U3  SN74ALVC244PW  [SOP65P640X120-20N]
U4  SN74ALVC244PW  [SOP65P640X120-20N]
U5  BSS138TA  [SOT95P240X110-3N]
U6  BSS138TA  [SOT95P240X110-3N]
X2  F15HDH  [HDF15H]

### Nets
+3V3: C32.2 C33.2 C35.2 U2.20(VCC) U3.20(VCC) U4.20(VCC) U5.1(G) U6.1(G) ; also sheet 1,2,3,4
+5V: R57.1 R58.1 ; also sheet 1,3,4,5
CSI_D0/LCD_D2: U2.6(1A3) ; also sheet 1,2,5
CSI_D1/LCD_D3: U2.8(1A4) ; also sheet 1,2,5
CSI_D2/LCD_D4: U2.11(2A1) ; also sheet 1,2,5
CSI_D3/LCD_D5: U2.13(2A2) ; also sheet 1,2,5
CSI_D4/LCD_D6: U2.15(2A3) ; also sheet 1,2,5
CSI_D5/LCD_D7: U2.17(2A4) ; also sheet 1,2,5
CSI_D6/LCD_D10: U3.6(1A3) ; also sheet 1,2,5
CSI_D7/LCD_D11: U3.8(1A4) ; also sheet 1,2,5
CSI_D8/LCD_D12: U3.11(2A1) ; also sheet 1,2,5
CSI_D9/LCD_D13: U3.13(2A2) ; also sheet 1,2,5
CSI_D10/LCD_D14: U3.15(2A3) ; also sheet 1,2,5
CSI_D11/LCD_D15: U3.17(2A4) ; also sheet 1,2,5
CSI_D12/LCD_D18: U4.6(1A3) ; also sheet 1,2,5
CSI_D13/LCD_D19: U4.8(1A4) ; also sheet 1,2,5
CSI_D14/LCD_D20: U4.11(2A1) ; also sheet 1,2,5
CSI_D15/LCD_D21: U4.13(2A2) ; also sheet 1,2,5
CSI_HSYNC/LCD_HSYNC: U6.2(S) ; also sheet 1,2,5
CSI_VSYNC/LCD_VSYNC: U5.2(S) ; also sheet 1,2,5
GND: C32.1 C33.1 C35.1 U2.1(1~OE) U2.2(1A1) U2.4(1A2) U2.10(GND) U2.19(2~OE) U3.1(1~OE) U3.2(1A1) U3.4(1A2) U3.10(GND) U3.19(2~OE) U4.1(1~OE) U4.2(1A1) U4.4(1A2) U4.10(GND) U4.19(2~OE) X2.6 X2.7 X2.8 X2.10 ; also sheet 1,2,3,4,5
LCD_D22: U4.15(2A3) ; also sheet 1,2
LCD_D23: U4.17(2A4) ; also sheet 1,2
N$14: R4.2 U2.14(1Y3)
N$15: R5.2 U2.12(1Y4)
N$16: R6.2 U2.9(2Y1)
N$17: R7.2 U2.7(2Y2)
N$19: R18.2 U2.5(2Y3)
N$24: R31.2 U2.3(2Y4)
N$25: R33.2 U3.14(1Y3)
N$27: R34.2 U3.12(1Y4)
N$31: R35.2 U3.9(2Y1)
N$34: R37.2 U3.7(2Y2)
N$37: R46.2 U3.5(2Y3)
N$38: R48.2 U3.3(2Y4)
N$39: R56.2 U4.3(2Y4)
N$40: R55.2 U4.5(2Y3)
N$44: R54.2 U4.7(2Y2)
N$45: R51.2 U4.9(2Y1)
N$50: R50.2 U4.12(1Y4)
N$51: R49.2 U4.14(1Y3)
VGA_B: R4.1 R5.1 R6.1 R7.1 R18.1 R31.1 X2.3
VGA_G: R33.1 R34.1 R35.1 R37.1 R46.1 R48.1 X2.2
VGA_HSYNC: R58.2 U6.3(D) X2.13
VGA_R: R49.1 R50.1 R51.1 R54.1 R55.1 R56.1 X2.1
VGA_VSYNC: R57.2 U5.3(D) X2.14
Unconnected: U2.16(1Y2) U2.18(1Y1) U3.16(1Y2) U3.18(1Y1) U4.16(1Y2) U4.18(1Y1) X2.4 X2.5 X2.9 X2.11 X2.12 X2.15

## Library data of the parts
ANT2 = Seeed-Connector:ANTENNA-CONN-U-FL(3P): 320110048
C1-C18 C20-C39 C47-C67 C69-C71 C73-C76 = rcl:C-EU: CAPACITOR, European symbol
C40-C46 C77-C84 = rcl:C-EU: CAPACITOR, European symbol; SPICEPREFIX: C
CN2 = adafruit:DCBARREL: 2.0mm DC Barrel Jack DCJACK_2MM_PTH - Through Hole Jack (4UConnector: 05537)
D1 = diode:DIODE-: DIODE
F1 = adafruit:PTCFUSE: PTC fuses, resettable thermistors
H1-H4 = holes:MOUNT-HOLE: MOUNTING HOLE with drill center marker
IC1 = v-reg-2:LM1117
J1 = SD-Kartenhalter:TRANSFLASH: TransFlash TF Micro SD Card Socket Adapter
J2 = SparkFun-Connectors:AUDIO_JACK_TRRS: Audio Jack - 3.5mm TRRS (SMD) This is a 3.5mm TRRS SMD audio jack. TRRS connectors are the audio-style connectors that you see on some phones, MP3 players and development boards. TRRS stands for “tip, ring, ring, sleeve,” which reflects that this has three conductors and a ground. SparkFun Products: Audio Jack <https://www.sparkfun.com/products/12639> mbed Starter Kit <https://www.sparkfun.com/products/12968> SparkFun TRRS 3.5mm Jack Breakout <https://www.sparkfun.com/products/11570>; PROD_ID: CONN-10676; SF_ID: PRT-12639
J3 = adafruit:40PINFPC: OMRON FPC Connector Source : http://www.omron.com/ecb/products/pdf/fpc.pdf XF2M-4015-rev is good for connecting up 'PSP' SHARP LQ043 LCDs
J4 = EAGLE-FPC_CONNECTOR_AND_FFC_CAB-rev16b:68611514122: WR-FPC 1.00mm SMT ZIF Horizontal Top Contact, 15 Pins=>Code : Con_FPC_ZIF_1.00_68611514122 <http://katalog.we-online.de/media/images/eican/Con_FPC_ZIF_1.00_6861xx14122_pf2.jpg> Details see: http://katalog.we-online.de/en/em/686_1xx_141_22 Created 2014-07-09, Karrer Zheng 2014 (C) Würth Elektronik
JP1 = pinhead:PINHD-2X13: PIN HEADER
JP3 JP5 JP7 = pinhead:PINHD-1X3: PIN HEADER
JP6 = pinhead:PINHD-2X9: PIN HEADER
JP10 = pinhead:PINHD-2X10: PIN HEADER
L1 L2 = rcl:L-EU: INDUCTOR, European symbol
LED1 LED2 = led:LED: LED OSRAM: - CHIPLED LG R971, LG N971, LY N971, LG Q971, LY Q971, LO R971, LY R971 LH N974, LH R974 LS Q976, LO Q976, LY Q976 LO Q996 - Hyper CHIPLED LW Q18S LB Q993, LB Q99A, LB R99A - SideLED LS A670, LO A670, LY A670, LG A670, LP A670 LB A673, LV A673, LT A673, LW A673 LH A674 LY A675 LS A676, LA A676, LO A676, LY A676, LW A676 LS A679, LY A679, LG A679 - Hyper Micro SIDELED® LS Y876, LA Y876, LO Y876, LY Y876 LT Y87S - SmartLED LW L88C, LW L88S LB L89C, LB L89S, LG L890 LS L89K, LO L89K, LY L89K LS L896, LA L896, LO L896, LY L896 - TOPLED LS T670, LO T670, LY T670, LG T670, LP T670 LSG T670, LSP T670, LSY T670, LOP T670, LYG T670 LG T671, LOG T671, LSG T671 LB T673, LV T673, LT T673, LW T673 LH T674 LS T676, LA T676, LO T676, LY T676, LB T676, LH T676, LSB T676, LW T676 LB T67C, LV T67C, LT T67C, LS T67K, LO T67K, LY T67K, LW E67C LS E67B, LA E67B, LO E67B, LY E67B, LB E67C, LV E67C, LT E67C LW T67C LS T679, LY T679, LG T679 LS T770, LO T770, LY T770, LG T770, LP T770 LB T773, LV T773, LT T773, LW T773 LH T774 LS E675, LA E675, LY E675, LS T675 LS T776, LA T776, LO T776, LY T776, LB T776 LHGB T686 LT T68C, LB T68C - Hyper Mini TOPLED® LB M676 - Mini TOPLED Santana® LG M470 LS M47K, LO M47K, LY M47K Source: http://www.osram.convergy.de LUXEON: - LUMILED® LXK2-PW12-R00, LXK2-PW12-S00, LXK2-PW14-U00, LXK2-PW14-V00 LXK2-PM12-R00, LXK2-PM12-S00, LXK2-PM14-U00 LXK2-PE12-Q00, LXK2-PE12-R00, LXK2-PE12-S00, LXK2-PE14-T00, LXK2-PE14-U00 LXK2-PB12-K00, LXK2-PB12-L00, LXK2-PB12-M00, LXK2-PB14-N00, LXK2-PB14-P00, LXK2-PB14-Q00 LXK2-PR12-L00, LXK2-PR12-M00, LXK2-PR14-Q00, LXK2-PR14-R00 LXK2-PD12-Q00, LXK2-PD12-R00, LXK2-PD12-S00 LXK2-PH12-R00, LXK2-PH12-S00 LXK2-PL12-P00, LXK2-PL12-Q00, LXK2-PL12-R00 Source: www.luxeon.com KINGBRIGHT: KA-3528ASYC Source: www.kingbright.com
MIC = microphon:ELECTRET_MICROPHON-: Electret Condenser Microphone
Q1 = crystal:CRYSTAL: CRYSTAL; OC_FARNELL: 1666969; OC_NEWARK: unknown
Q2 = crystal:CRYSTAL: CRYSTAL; OC_FARNELL: unknown; OC_NEWARK: unknown
Q3 = crystal:CRYSTAL: CRYSTAL; OC_FARNELL: 1667008; OC_NEWARK: unknown
Q4 Q5 = transistor-small-signal:BSS123: N-CHANNEL MOS FET
R1-R19 R24-R58 R69-R71 = rcl:R-EU_: RESISTOR, European symbol
R59-R68 = rcl:R-EU_: RESISTOR, European symbol; SPICEPREFIX: R
RN1 RN2 = resistor-dil:4R-N: Array Chip Resistor Source: RS Component / Phycomp; OC_FARNELL: unknown; OC_NEWARK: unknown
U1 = SparkFun-IC-Memory:SPI_FLASH-X25XX: 32M Serial Flash Memory 8pin SPI Flash series x25xx. Works with devices like W25X32 and BR25L32 Datasheet <http://www.macronix.com/Lists/Datasheet/Attachments/5031/MX25L3206E,%203V,%2032Mb,%20v1.5.pdf> SparkFun Products SparkFun Venus GPS Logger <https://www.sparkfun.com/products/10920> (GPS-10920); PROD_ID: IC-09109
U2-U4 = Texas Instruments_By_element14_Batch_1:SN74ALVC244PW: OCTAL BUFFERS/DRIVERS WITH 3-STATE OUTPUTS; MPN: SN74ALVC244PW; OC_FARNELL: 1470750; OC_NEWARK: 36K3549; PACKAGE: TSSOP-20; SUPPLIER: Texas Instruments
U5 U6 = Diodes_Inc_By_element14_Batch_1:BSS138TA: N-CHANNEL ENHANCEMENT MODE MOSFET; MPN: BSS138TA; OC_FARNELL: 1471176; OC_NEWARK: 61M5072; PACKAGE: SOT-23-3; SUPPLIER: Diodes Inc
U$1 = Allwinner V3s:V3S
U$2 = RTL8723BS_Modul:RTL8723BS
U$3 = HR911105A:HR911105A
U$4 U$10 U$11 = MP1584-dc-brick:MP1584-MINI
U$5 = ADV7611:ADV7611
U$6 = XC6204:XC6204
U$7 = GeekAmmo:P-CHANNEL-MOSFET: P-Channel MOSFET Mode Field Effect Transistor
U$8 = NS2009:NS2009
U$9 = PT4101:PT4101
U$12 = connectors:HDMI-A: Horizonal HDMI type "A" jack
U$13 = XC6210:XC6210
U$14 = RT9013:RT9013
U$15 = Blueberry Pi:CON-HIROSE_MICRO-USB-SHIELD-: Hirose Micro USB Connector ZX62R-B-5P: Micro B, reverse (top mount) shell SMT Supplier: DigiKey H11574CT-ND Source: http://www.hirose.co.jp/cataloge_hp/e24200011.pdf
X1 = con-usb:USB: USB Connectors
X2 = adafruit:F15: SUB-D HDH is also known as a 'right angle VGA' connector

## Net classes
0 default: clearance 0.152 mm